# Altium project RK3288.PrjPcb (part 2 of 2)

## Sheet 19.SchDoc
size 297 x 209 mm
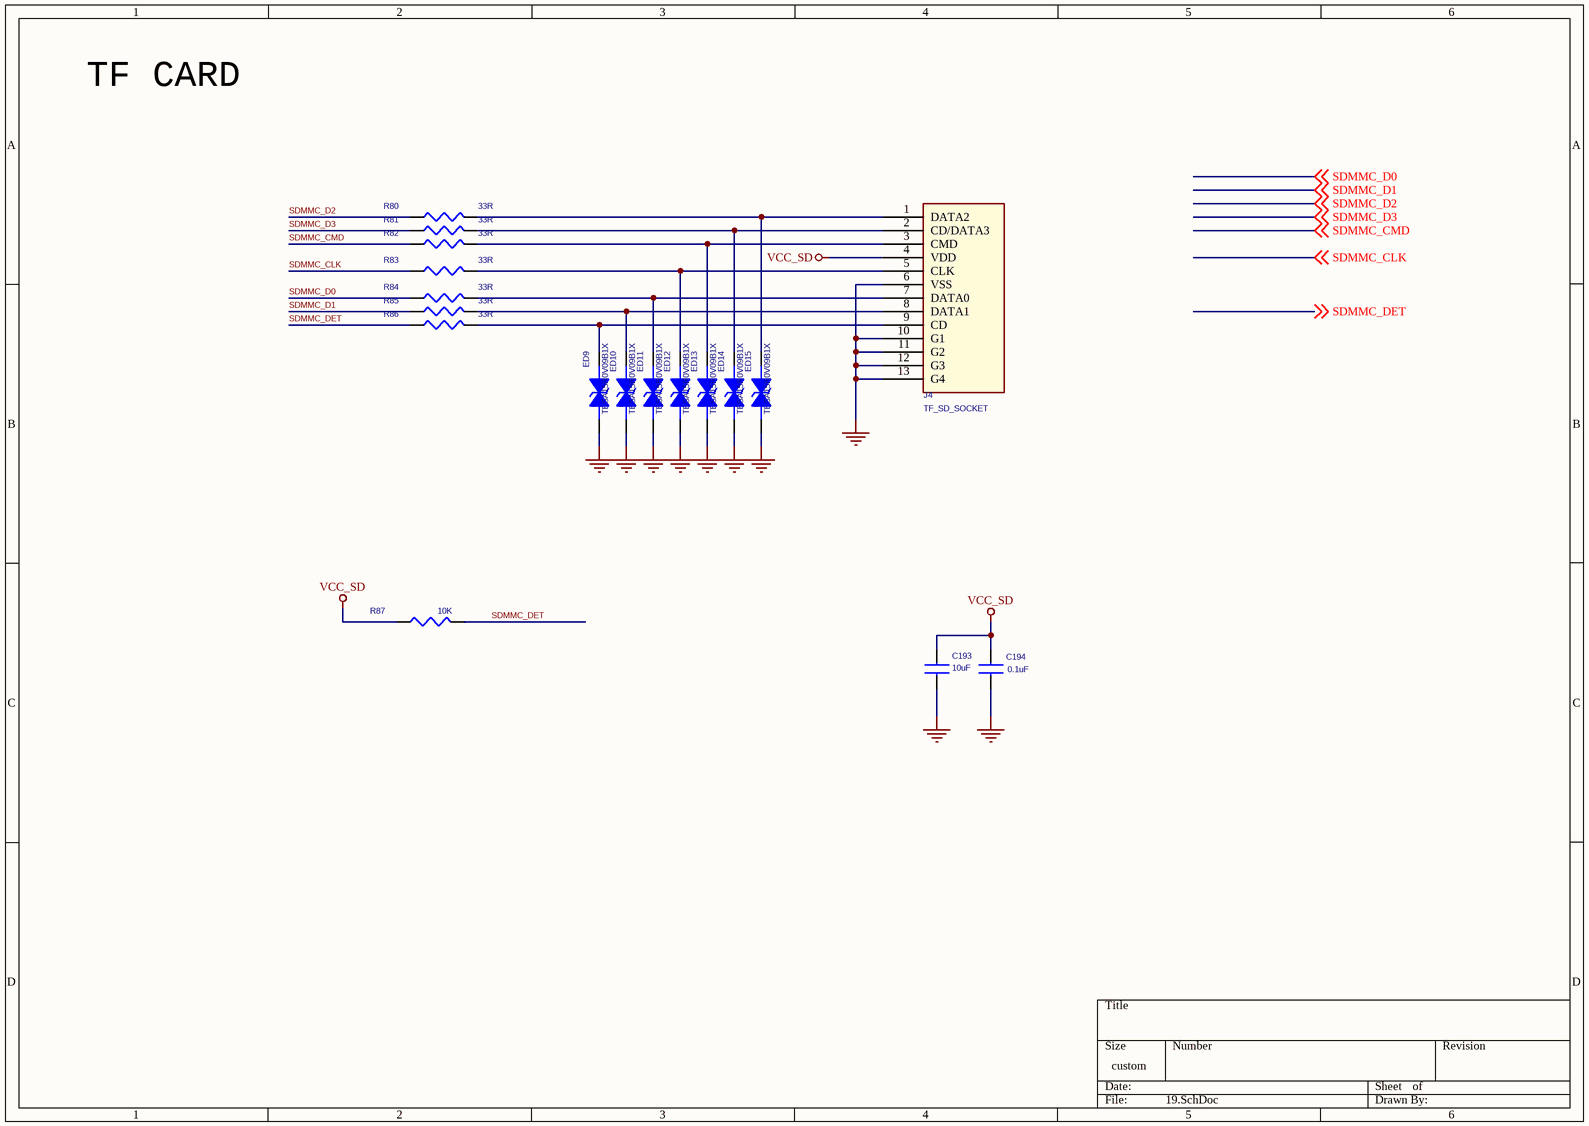
[diagram p19: 19.SchDoc]

### Parts
C193  10uF  [C0603]
C194  0.1uF  [C0603]
ED9  TESA15R0V09B1X  [E0402N]
ED10  TESA15R0V09B1X  [E0402N]
ED11  TESA15R0V09B1X  [E0402N]
ED12  TESA15R0V09B1X  [E0402N]
ED13  TESA15R0V09B1X  [E0402N]
ED14  TESA15R0V09B1X  [E0402N]
ED15  TESA15R0V09B1X  [E0402N]
J4  TF_SD_SOCKET  [TF-CARDKLJ07002]
R80  33R  [r0402]
R81  33R  [r0402]
R82  33R  [r0402]
R83  33R  [r0402]
R84  33R  [r0402]
R85  33R  [r0402]
R86  33R  [r0402]
R87  10K  [r0402]

### Nets
GND: C193.1 C194.2 ED9.2 ED10.2 ED11.2 ED12.2 ED13.2 ED14.2 ED15.2 J4.6(VSS) J4.10(G1) J4.11(G2) J4.12(G3) J4.13(G4)
VCC_SD: C193.2 C194.1 J4.4(VDD) R87.1
SDMMC_CLK: R83.1 ; off-sheet SDMMC_CLK
SDMMC_CMD: R82.1 ; off-sheet SDMMC_CMD
SDMMC_D0: R84.1 ; off-sheet SDMMC_D0
SDMMC_D1: R85.1 ; off-sheet SDMMC_D1
SDMMC_D2: R80.1 ; off-sheet SDMMC_D2
SDMMC_D3: R81.1 ; off-sheet SDMMC_D3
SDMMC_DET: R86.1 R87.2 ; off-sheet SDMMC_DET
NetED9_1: ED9.1 J4.9(CD) R86.2
NetED10_1: ED10.1 J4.8(DATA1) R85.2
NetED11_1: ED11.1 J4.7(DATA0) R84.2
NetED12_1: ED12.1 J4.5(CLK) R83.2
NetED13_1: ED13.1 J4.3(CMD) R82.2
NetED14_1: ED14.1 J4.2(CD/DATA3) R81.2
NetED15_1: ED15.1 J4.1(DATA2) R80.2

### Notes on the sheet
- TF CARD

### Library data of the parts
C193 = CAP NP_Dup3: CAP,MLCC,10uF,+/-10%,X5R,6.3V,SMD0805
C194 = CAP NP_Dup3: CAP,MLCC,100nF,+/-10%,X7R,6.3V,SMD0402
ED9-ED15 = TVS: ESD Component,5V,30P,SMD,0402
J4 = SD_SOCKET_0
R80-R87 = RESISTOR_1_Dup2

## Sheet 20.SchDoc
size 431 x 322 mm
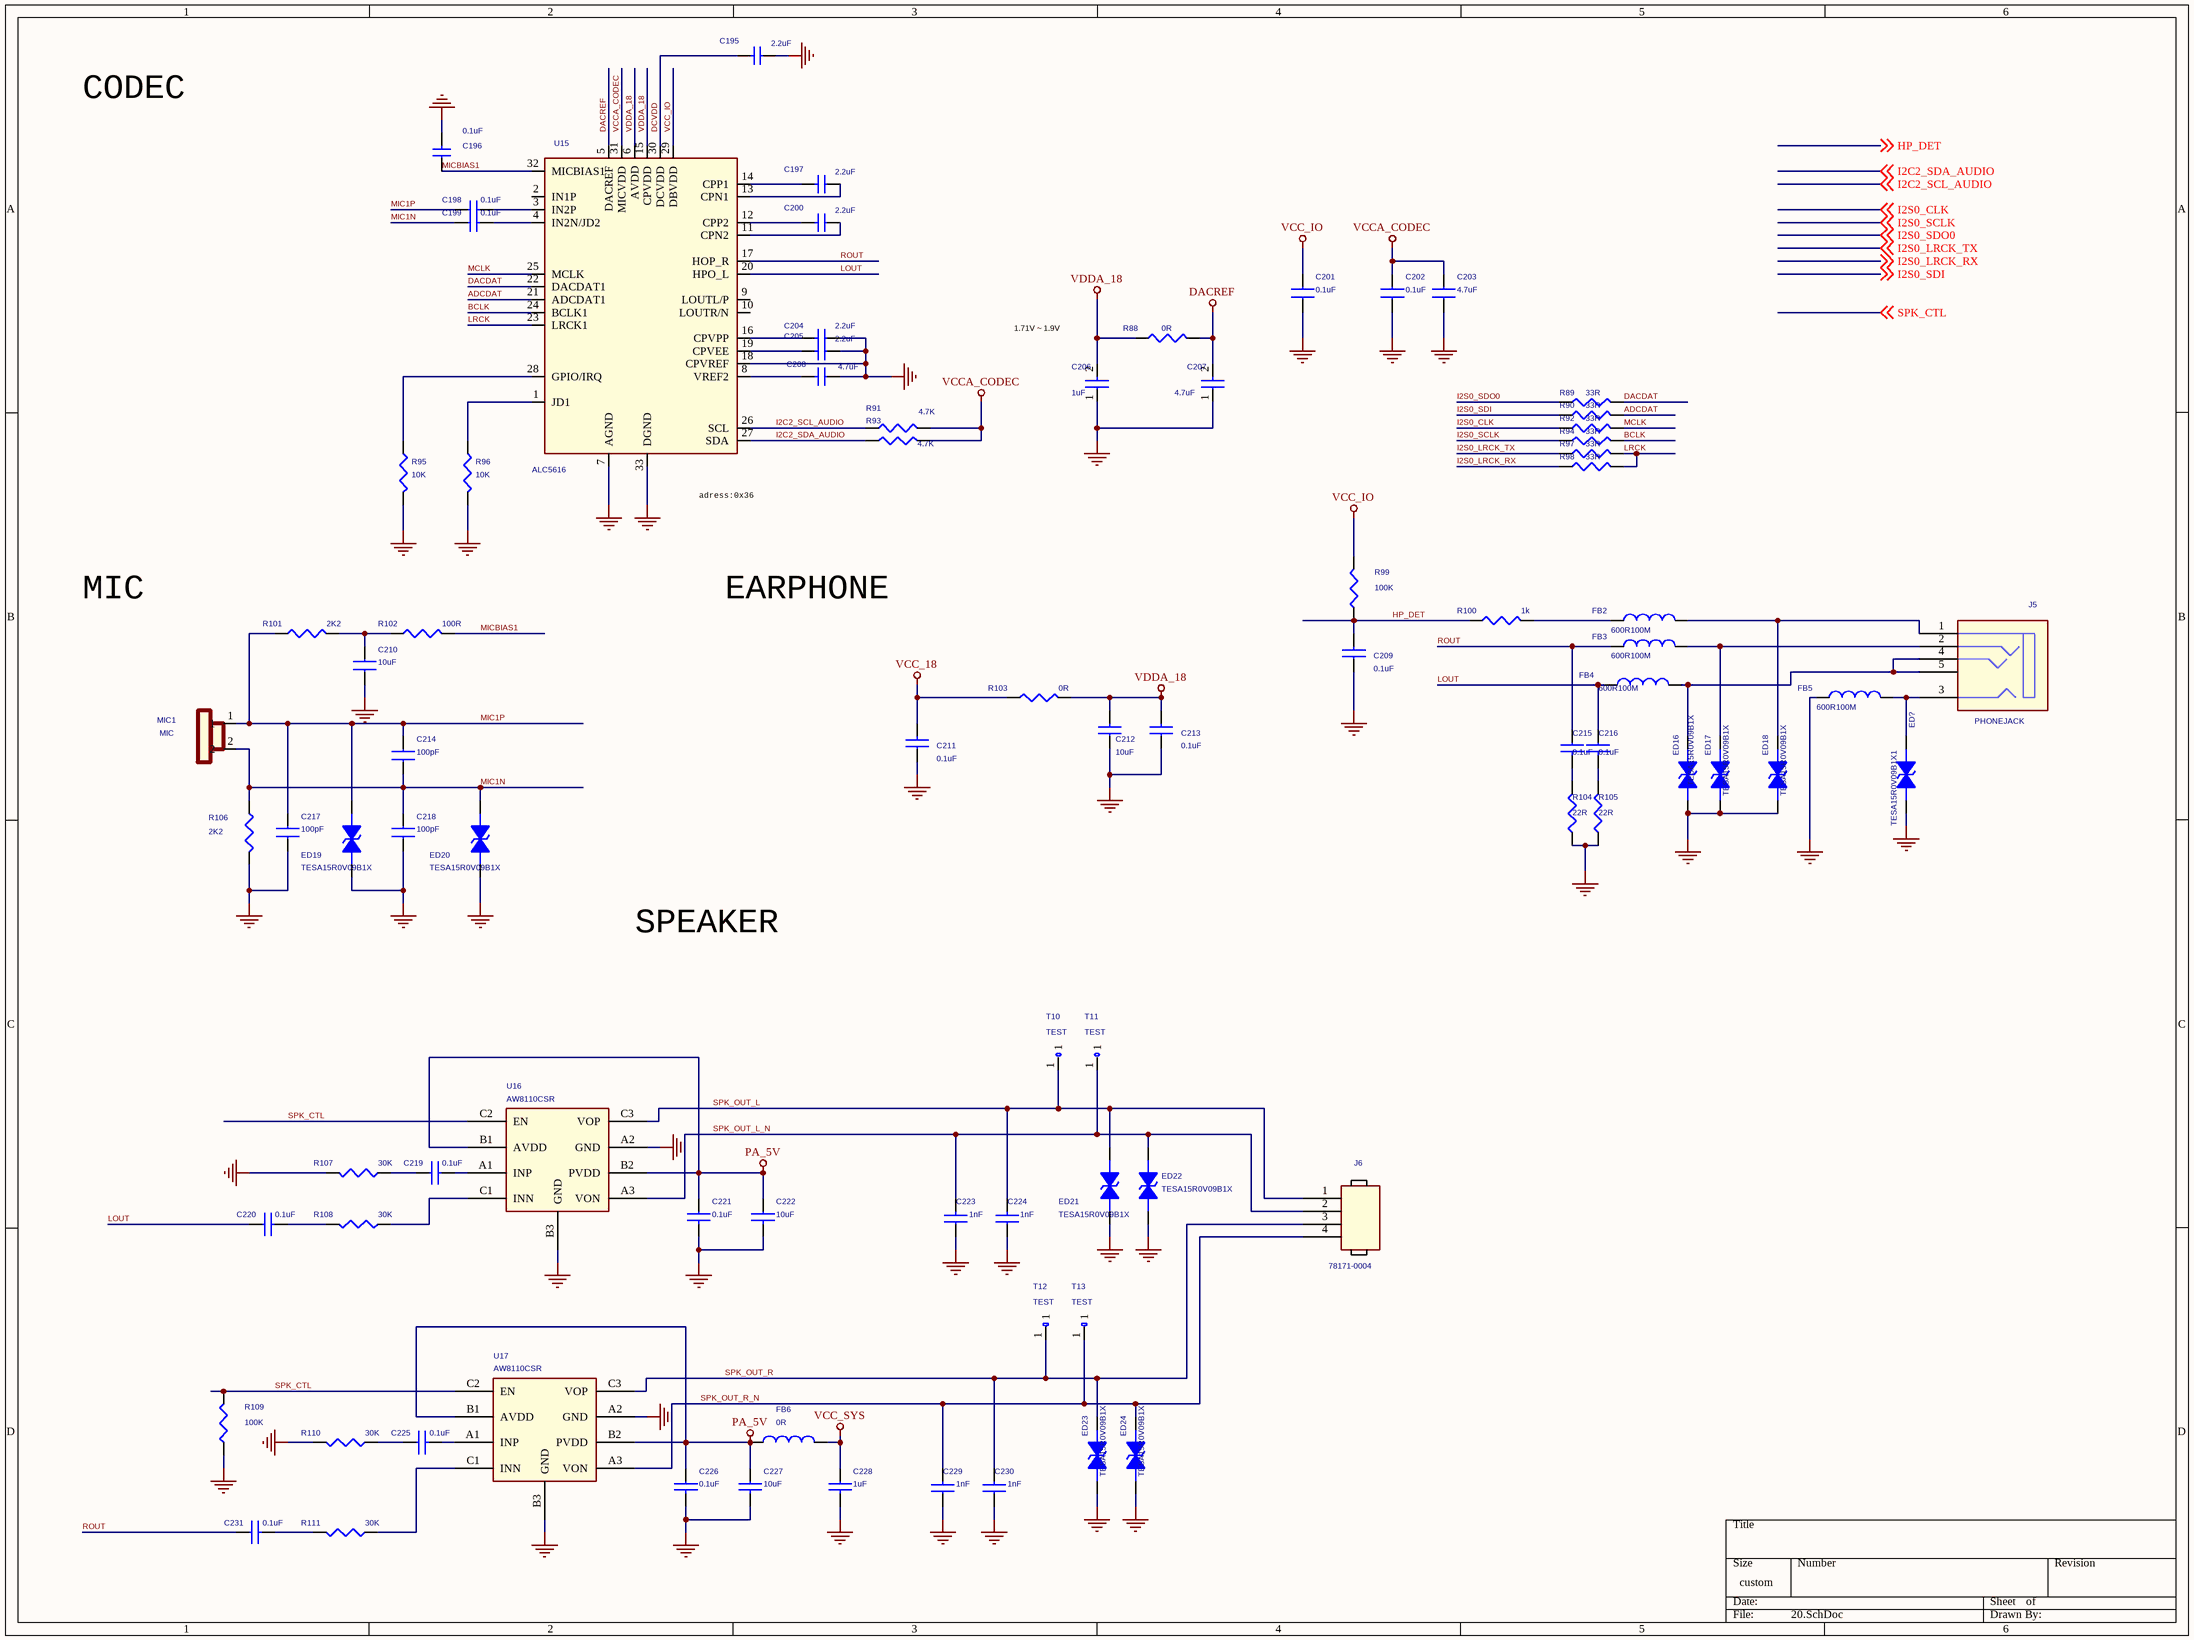
[diagram p20: 20.SchDoc]

### Parts
C195  2.2uF  [C0603]
C196  0.1uF  [c0402]
C197  2.2uF  [C0603]
C198  0.1uF  [c0402]
C199  0.1uF  [c0402]
C200  2.2uF  [C0603]
C201  0.1uF  [C0603]
C202  0.1uF  [C0603]
C203  4.7uF  [C0603]
C204  2.2uF  [C0603]
C205  2.2uF  [C0603]
C206  1uF  [c0402]
C207  4.7uF  [C0603]
C208  4.7uF  [C0603]
C209  0.1uF  [c0402]
C210  10uF  [C0603]
C211  0.1uF  [C0201]
C212  10uF  [C0603]
C213  0.1uF  [c0402]
C214  100pF  [C0603]
C215  0.1uF  [c0402]
C216  0.1uF  [c0402]
C217  100pF  [C0603]
C218  100pF  [C0603]
C219  0.1uF  [C0402]
C220  0.1uF  [C0402]
C221  0.1uF  [C0402]
C222  10uF  [C0402]
C223  1nF  [C0402]
C224  1nF  [C0402]
C225  0.1uF  [C0402]
C226  0.1uF  [C0402]
C227  10uF  [C0402]
C228  1uF  [C0402]
C229  1nF  [C0402]
C230  1nF  [C0402]
C231  0.1uF  [C0402]
ED16  TESA15R0V09B1X  [E0402N]
ED17  TESA15R0V09B1X  [E0402N]
ED18  TESA15R0V09B1X  [E0402N]
ED19  TESA15R0V09B1X  [E0201]
ED20  TESA15R0V09B1X  [E0201]
ED21  TESA15R0V09B1X  [E0201]
ED22  TESA15R0V09B1X  [E0201]
ED23  TESA15R0V09B1X  [E0402N]
ED24  TESA15R0V09B1X  [E0402N]
FB2  600R100M  [L0402]
FB3  600R100M  [L0402]
FB4  600R100M  [L0402]
FB5  600R100M  [L0402]
FB6  0R  [L0603]
J5  PHONEJACK  [J301R05GA6ZL2]
J6  78171-0004  [78171-0004]
MIC1  MIC  [78171-0002]
R88  0R  [R0402]
R89  33R  [r0402]
R90  33R  [r0402]
R91  4.7K  [r0402]
R92  33R  [r0402]
R93  4.7K  [r0402]
R94  33R  [r0402]
R95  10K  [r0402]
R96  10K  [r0402]
R97  33R  [r0402]
R98  33R  [r0402]
R99  100K  [r0402]
R100  1k  [r0402]
R101  2K2  [r0402]
R102  100R  [r0402]
R103  0R  [R0402]
R104  22R  [r0402]
R105  22R  [r0402]
R106  2K2  [r0402]
R107  30K  [R0402]
R108  30K  [R0402]
R109  100K  [r0402]
R110  30K  [R0402]
R111  30K  [R0402]
T10  TEST  [TEST]
T11  TEST  [TEST]
T12  TEST  [TEST]
T13  TEST  [TEST]
TESA15R0V09B1X1  ED?  [E0402N]
U15  ALC5616  [QFN32]
U16  AW8110CSR  [CSP9]
U17  AW8110CSR  [CSP9]

### Nets
DACREF: C207.2 R88.2 U15.5(DACREF)
GND: C195.1 C196.2 C201.1 C202.1 C203.1 C204.1 C205.1 C206.1 C207.1 C208.1 C209.1 C210.1 C211.1 C212.1 C213.1 C217.1 C218.1 C221.2 C222.2 C223.1 C224.1 C226.2 C227.2 C228.2 C229.1 C230.1 ED16.2 ED17.2 ED18.2 ED19.2 ED20.2 ED21.2 ED22.2 ED23.2 ED24.2 FB5.2 R95.1 R96.1 R104.1 R105.1 R106.1 R107.2 R109.2 R110.2 TESA15R0V09B1X1.2 U15.7(AGND) U15.18(CPVREF) U15.33(DGND) U16.A2(GND) U16.B3(GND) U17.A2(GND) U17.B3(GND)
PA_5V: C221.1 C222.1 C226.1 C227.1 FB6.2 U16.B1(AVDD) U16.B2(PVDD) U17.B1(AVDD) U17.B2(PVDD)
VCC_18: C211.2 R103.1
VCC_IO: C201.2 R99.1 U15.29(DBVDD)
VCC_SYS: C228.1 FB6.1
VCCA_CODEC: C202.2 C203.2 R91.2 R93.2 U15.31(MICVDD)
VDDA_18: C206.2 C212.2 C213.2 R88.1 R103.2 U15.6(AVDD) U15.15(CPVDD)
ADCDAT: R90.2 U15.21(ADCDAT1)
BCLK: R94.2 U15.24(BCLK1)
DACDAT: R89.2 U15.22(DACDAT1)
DCVDD: C195.2 U15.30(DCVDD)
HP_DET: C209.2 R99.2 R100.2 ; off-sheet HP_DET
I2C2_SCL_AUDIO: R91.1 U15.26(SCL) ; off-sheet I2C2_SCL_AUDIO
I2C2_SDA_AUDIO: R93.1 U15.27(SDA) ; off-sheet I2C2_SDA_AUDIO
I2S0_CLK: R92.1 ; off-sheet I2S0_CLK
I2S0_LRCK_RX: R98.1 ; off-sheet I2S0_LRCK_RX
I2S0_LRCK_TX: R97.1 ; off-sheet I2S0_LRCK_TX
I2S0_SCLK: R94.1 ; off-sheet I2S0_SCLK
I2S0_SDI: R90.1 ; off-sheet I2S0_SDI
I2S0_SDO0: R89.1 ; off-sheet I2S0_SDO0
LOUT: C216.1 C220.1 FB4.2 U15.20(HPO_L)
LRCK: R97.2 R98.2 U15.23(LRCK1)
MCLK: R92.2 U15.25(MCLK)
MIC1N: C199.1 C214.1 C218.2 ED20.1 MIC1.2 R106.2
MIC1P: C198.1 C214.2 C217.2 ED19.1 MIC1.1 R101.1
MICBIAS1: C196.1 R102.1 U15.32(MICBIAS1)
ROUT: C215.1 C231.1 FB3.2 U15.17(HOP_R)
SPK_CTL: R109.1 U16.C2(EN) U17.C2(EN) ; off-sheet SPK_CTL
SPK_OUT_L: C224.2 ED21.1 J6.1 T10.1 U16.C3(VOP)
SPK_OUT_L_N: C223.2 ED22.1 J6.2 T11.1 U16.A3(VON)
SPK_OUT_R: C230.2 ED23.1 J6.3 T12.1 U17.C3(VOP)
SPK_OUT_R_N: C229.2 ED24.1 J6.4 T13.1 U17.A3(VON)
NetC197_1: C197.1 U15.13(CPN1)
NetC197_2: C197.2 U15.14(CPP1)
NetC198_2: C198.2 U15.3(IN2P)
NetC199_2: C199.2 U15.4(IN2N/JD2)
NetC200_1: C200.1 U15.11(CPN2)
NetC200_2: C200.2 U15.12(CPP2)
NetC204_2: C204.2 U15.16(CPVPP)
NetC205_2: C205.2 U15.19(CPVEE)
NetC208_2: C208.2 U15.8(VREF2)
NetC210_2: C210.2 R101.2 R102.2
NetC215_2: C215.2 R104.2
NetC216_2: C216.2 R105.2
NetC219_1: C219.1 R107.1
NetC219_2: C219.2 U16.A1(INP)
NetC220_2: C220.2 R108.2
NetC225_1: C225.1 R110.1
NetC225_2: C225.2 U17.A1(INP)
NetC231_2: C231.2 R111.2
NetED16_1: ED16.1 FB4.1 J5.4(R) J5.5(L)
NetED17_1: ED17.1 FB3.1 J5.2(D)
NetED18_1: ED18.1 FB2.1 J5.1(HP)
NetFB2_2: FB2.2 R100.1
NetFB5_1: FB5.1 J5.3(R1) TESA15R0V09B1X1.1
NetR95_2: R95.2 U15.28(GPIO/IRQ)
NetR96_2: R96.2 U15.1(JD1)
NetR108_1: R108.1 U16.C1(INN)
NetR111_1: R111.1 U17.C1(INN)

Not connected (* = marked no-connect by the designer): U15 2(IN1P) 9(LOUTL/P) 10(LOUTR/N)

### Notes on the sheet
- CODEC
- 1.71V ~ 1.9V
- (near U15) adress:0x36
- MIC
- EARPHONE
- SPEAKER

### Library data of the parts
C195 C197 C200 C204 C205 = SMALL CAP: RoHS CHIP CAP 2.2uF +10/-10% X5R
C196 C198 C199 = SMALL CAP: RoHS CHIP CAP 0.1uF +10/-10% X7R
C201 C202 = CAP NP_Dup3: RoHS CHIP CAP 0.1uF +10/-10% X7R
C203 = CAP NP_Dup3: RoHS CHIP CAP 2.2uF +10/-10% X5R
C206 C207 = CAP NP_0: RoHS CHIP CAP 4.7uF +10/-10% X5R
C208 = SMALL CAP: RoHS CHIP CAP 4.7uF +10/-10% X5R
C209 C211-C213 = CAP NP_4
C210 = CAP NP_Dup3
C214 C217 C218 = CAP NP_Dup3: RoHS CHIP CAP 100pF +10/-10% X7R
C215 C216 = CAP NP_Dup1: RoHS CHIP CAP 0.1uF +10/-10% X7R
C219-C221 C225 C226 C231 = CAP NP_Dup2: RoHS CHIP CAP 0.1uF +10/-10% X7R
C222 C227 C228 = CAP NP_Dup2: RoHS CHIP CAP 10uF +10/-10% X5R; ROOM: USB+5V; MARK: 106
C223 C224 C229 C230 = CAP NP_Dup2: RoHS CHIP CAP 1nF +10/-10% X7R
ED16-ED18 ED23 ED24 TESA15R0V09B1X1 = TVS: ESD Component,5V,30P,SMD,0402
ED19-ED22 = DIODE BI-DIR TRIG: NC/ESD Component,5V,30P,SMD,0402
FB2-FB5 = INDUCTOR_Dup1: ROHS CHIP RES 33R 1/16W 5%; Supplier: MURATA; Supplier P/N: BLM18PG181SN1D
FB6 = INDUCTOR_Dup1: ROHS CHIP RES 0 Ohm 1/16W +/-5%; Supplier P/N: BLM18PG181SN1D; Supplier: MURATA
J5 = PHONEJACK STEREO SW_0: 耳插
J6 = HEADER 4
R88 R91 R93 = R: ROHS CHIP RES 0 Ohm 1/16W +/-5%
R89 R90 R92 R94 R97 R98 = R: ROHS CHIP RES 33 Ohm 1/16W +/-5%
R95 R96 = RESISTOR: ROHS CHIP RES 10K 1/16W +/-5%
R99 R100 R102 R109 = RESISTOR_1_Dup2: RES,thick film,10KOhm,+/-5%,1/16W,SMD0402
R101 = RESISTOR_0_Dup2
R103 = RESISTOR: ROHS CHIP RES 0R 1/16W 5%
R104 R105 = RESISTOR: ROHS CHIP RES 22R 1/16W 5%
R106 = RESISTOR_0_Dup2: 贴片电阻
R107 R108 R110 R111 = RESISTOR_Dup1: ROHS CHIP RES 30K 1/16W +/-5%
T10-T13 = TEST_0
U15 = ALC5616: CODEC IC
U16 U17 = LM4990_0: Class D Audio AMP

## Sheet 21.SchDoc
size 297 x 209 mm
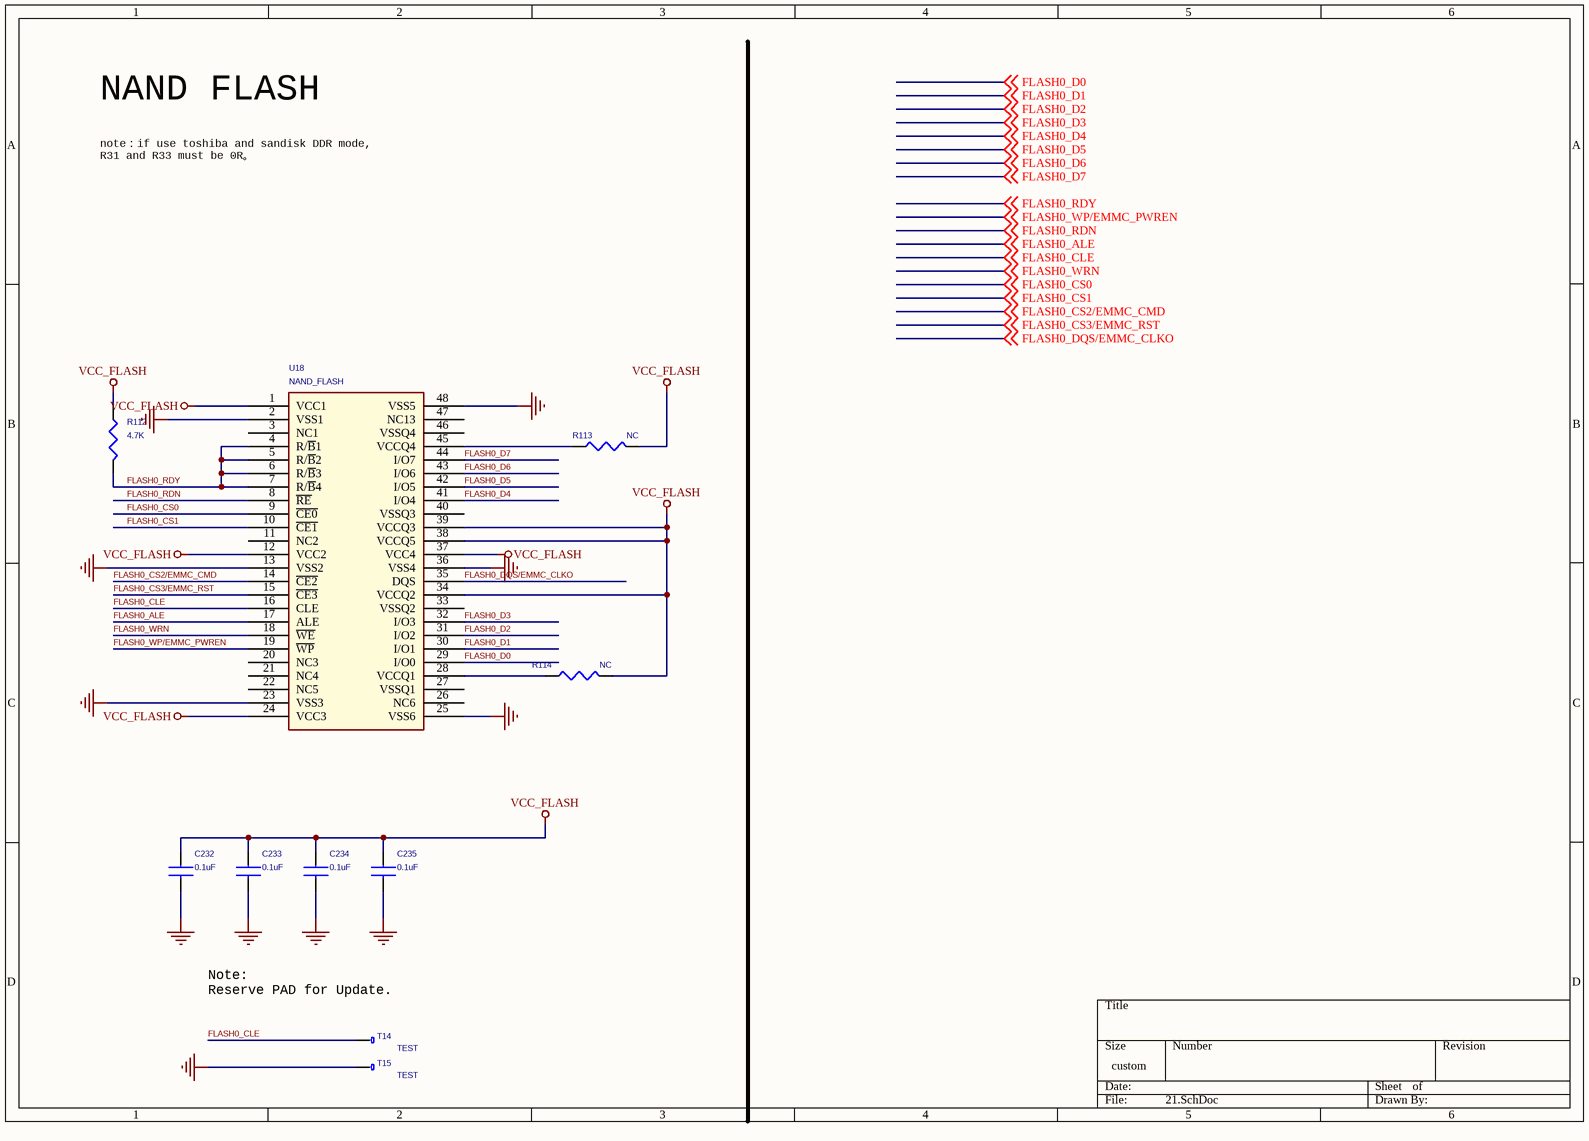
[diagram p21: 21.SchDoc]

### Parts
C232  0.1uF  [C0603]
C233  0.1uF  [C0603]
C234  0.1uF  [C0603]
C235  0.1uF  [C0603]
R112  4.7K  [R0402]
R113  NC  [R0402]
R114  NC  [R0402]
T14  TEST  [TEST]
T15  TEST  [TEST]
U18  NAND_FLASH  [TSOP1-48]

### Nets
GND: C232.1 C233.1 C234.1 C235.1 T15.1 U18.2(VSS1) U18.13(VSS2) U18.23(VSS3) U18.25(VSS6) U18.36(VSS4) U18.48(VSS5)
VCC_FLASH: C232.2 C233.2 C234.2 C235.2 R112.1 R113.2 R114.2 U18.1(VCC1) U18.12(VCC2) U18.24(VCC3) U18.34(VCCQ2) U18.37(VCC4) U18.38(VCCQ5) U18.39(VCCQ3)
FLASH0_ALE: U18.17(ALE) ; off-sheet FLASH0_ALE
FLASH0_CLE: T14.1 U18.16(CLE) ; off-sheet FLASH0_CLE
FLASH0_CS0: U18.9(~{CE0}) ; off-sheet FLASH0_CS0
FLASH0_CS1: U18.10(~{CE1}) ; off-sheet FLASH0_CS1
FLASH0_CS2/EMMC_CMD: U18.14(~{CE2}) ; off-sheet FLASH0_CS2/EMMC_CMD
FLASH0_CS3/EMMC_RST: U18.15(~{CE3}) ; off-sheet FLASH0_CS3/EMMC_RST
FLASH0_D0: U18.29(I/O0) ; off-sheet FLASH0_D0
FLASH0_D1: U18.30(I/O1) ; off-sheet FLASH0_D1
FLASH0_D2: U18.31(I/O2) ; off-sheet FLASH0_D2
FLASH0_D3: U18.32(I/O3) ; off-sheet FLASH0_D3
FLASH0_D4: U18.41(I/O4) ; off-sheet FLASH0_D4
FLASH0_D5: U18.42(I/O5) ; off-sheet FLASH0_D5
FLASH0_D6: U18.43(I/O6) ; off-sheet FLASH0_D6
FLASH0_D7: U18.44(I/O7) ; off-sheet FLASH0_D7
FLASH0_DQS/EMMC_CLKO: U18.35(DQS) ; off-sheet FLASH0_DQS/EMMC_CLKO
FLASH0_RDN: U18.8(~{RE}) ; off-sheet FLASH0_RDN
FLASH0_RDY: R112.2 U18.4(R/~{B}1) U18.5(R/~{B}2) U18.6(R/~{B}3) U18.7(R/~{B}4) ; off-sheet FLASH0_RDY
FLASH0_WP/EMMC_PWREN: U18.19(~{WP}) ; off-sheet FLASH0_WP/EMMC_PWREN
FLASH0_WRN: U18.18(~{WE}) ; off-sheet FLASH0_WRN
NetR113_1: R113.1 U18.45(VCCQ4)
NetR114_1: R114.1 U18.28(VCCQ1)

Not connected (* = marked no-connect by the designer): U18 3(NC1) 11(NC2) 20(NC3) 21(NC4) 22(NC5) 26(NC6) 27(VSSQ1) 33(VSSQ2) 40(VSSQ3) 46(VSSQ4) 47(NC13)

### Notes on the sheet
- NAND FLASH
- note：if use toshiba and sandisk DDR mode,
  R31 and R33 must be 0R。
- (near T14) Note:
  Reserve PAD for Update.

### Library data of the parts
C232-C235 = CAP NP_Dup3: RoHS CHIP CAP 0.1uF +10/-10% X7R
R112 = RESISTOR_Dup1: ROHS CHIP RES 4.7K 1/16W +/-5%
R113 R114 = RESISTOR_Dup1
T14 T15 = TEST_1
U18 = NANDFLASH_0: NAND Flash,2.7V,3.3V,3.6V,2G*8,N/A,-40℃~85℃,TSOP-48P; NAND FLASH: 1

## Sheet 22.SchDoc
size 297 x 209 mm
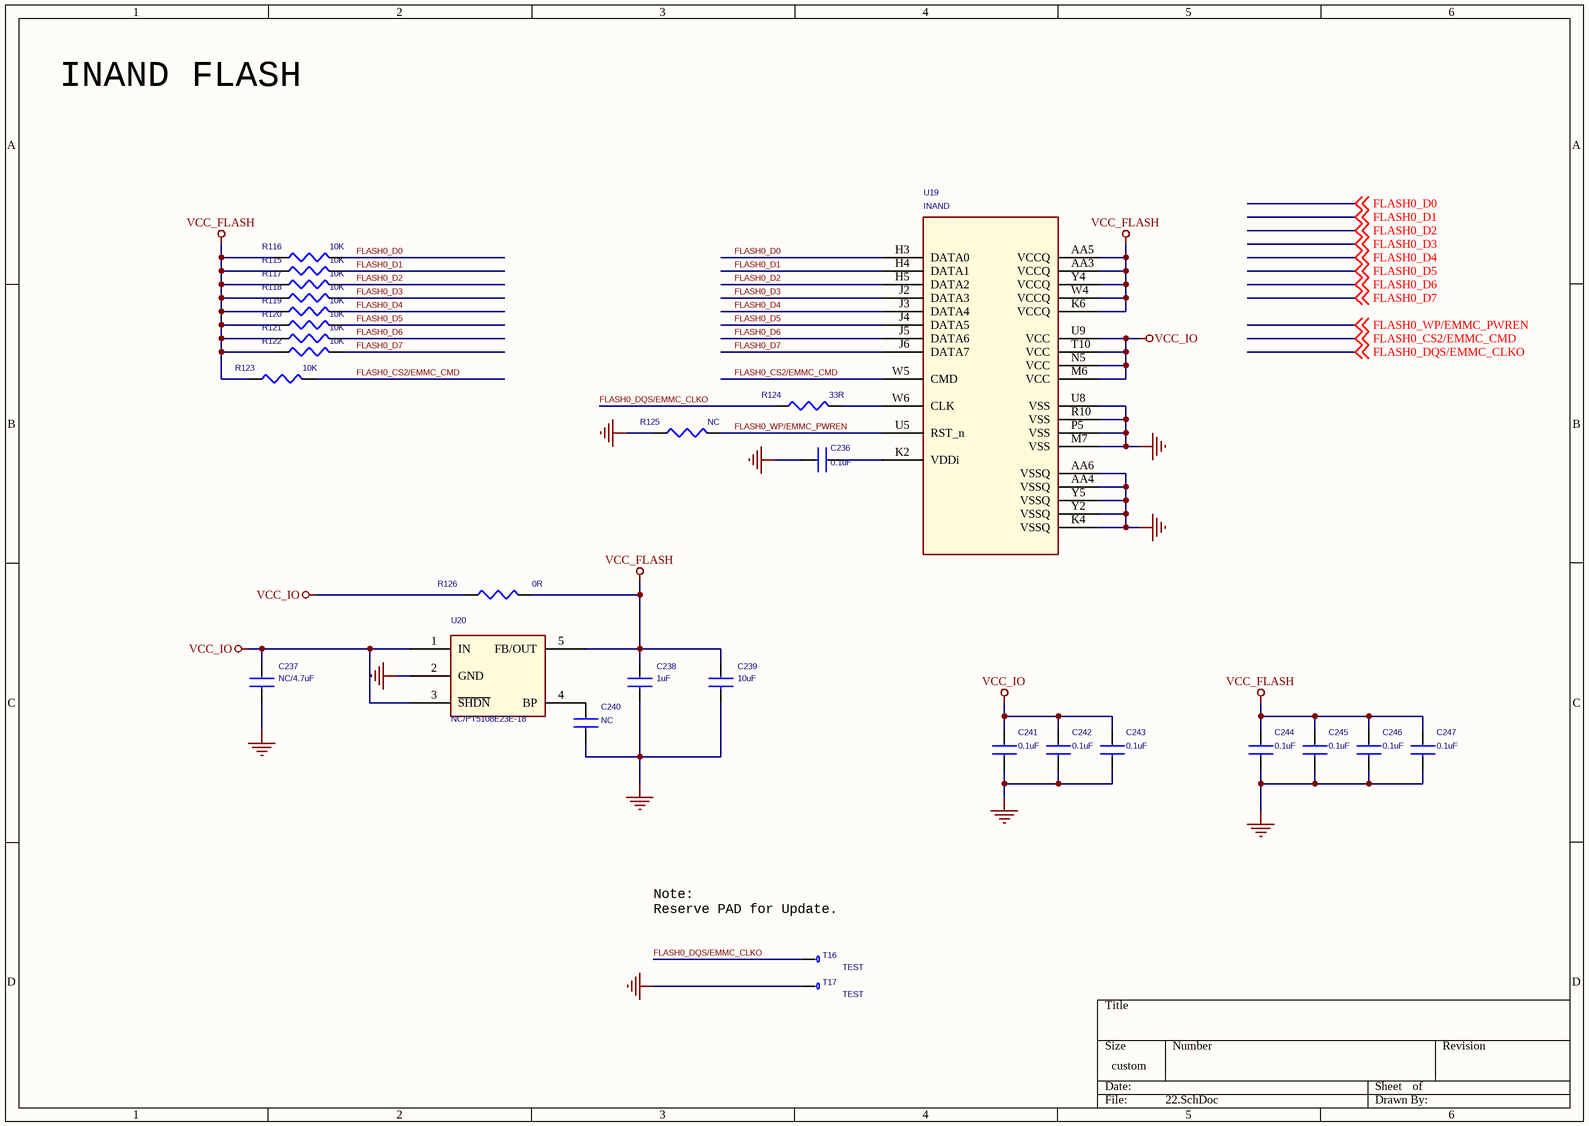
[diagram p22: 22.SchDoc]

### Parts
C236  0.1uF  [C0603]
C237  NC/4.7uF  [C0603]
C238  1uF  [C0603]
C239  10uF  [C0603]
C240  NC  [C0603]
C241  0.1uF  [C0603]
C242  0.1uF  [C0603]
C243  0.1uF  [C0603]
C244  0.1uF  [C0603]
C245  0.1uF  [C0603]
C246  0.1uF  [C0603]
C247  0.1uF  [C0603]
R115  10K  [R0402]
R116  10K  [R0402]
R117  10K  [R0402]
R118  10K  [R0402]
R119  10K  [R0402]
R120  10K  [R0402]
R121  10K  [R0402]
R122  10K  [R0402]
R123  10K  [R0402]
R124  33R  [R0402]
R125  NC  [R0402]
R126  0R  [R0402]
T16  TEST  [TEST]
T17  TEST  [TEST]
U19  INAND  [INANA-BGA169]
U20  NC/PT5108E23E-18  [SOT25]

### Nets
GND: C236.1 C237.2 C238.2 C239.2 C240.1 C241.1 C242.1 C243.1 C244.1 C245.1 C246.1 C247.1 R125.1 T17.1 U19.AA4(VSSQ) U19.AA6(VSSQ) U19.K4(VSSQ) U19.M7(VSS) U19.P5(VSS) U19.R10(VSS) U19.U8(VSS) U19.Y2(VSSQ) U19.Y5(VSSQ) U20.2(GND)
VCC_FLASH: C238.1 C239.1 C244.2 C245.2 C246.2 C247.2 R115.1 R116.1 R117.1 R118.1 R119.1 R120.1 R121.1 R122.1 R123.1 R126.2 U19.AA3(VCCQ) U19.AA5(VCCQ) U19.K6(VCCQ) U19.W4(VCCQ) U19.Y4(VCCQ) U20.5(FB/OUT)
VCC_IO: C237.1 C241.2 C242.2 C243.2 R126.1 U19.M6(VCC) U19.N5(VCC) U19.T10(VCC) U19.U9(VCC) U20.1(IN) U20.3(~{SHDN})
FLASH0_CS2/EMMC_CMD: R123.2 U19.W5(CMD) ; off-sheet FLASH0_CS2/EMMC_CMD
FLASH0_D0: R116.2 U19.H3(DATA0) ; off-sheet FLASH0_D0
FLASH0_D1: R115.2 U19.H4(DATA1) ; off-sheet FLASH0_D1
FLASH0_D2: R117.2 U19.H5(DATA2) ; off-sheet FLASH0_D2
FLASH0_D3: R118.2 U19.J2(DATA3) ; off-sheet FLASH0_D3
FLASH0_D4: R119.2 U19.J3(DATA4) ; off-sheet FLASH0_D4
FLASH0_D5: R120.2 U19.J4(DATA5) ; off-sheet FLASH0_D5
FLASH0_D6: R121.2 U19.J5(DATA6) ; off-sheet FLASH0_D6
FLASH0_D7: R122.2 U19.J6(DATA7) ; off-sheet FLASH0_D7
FLASH0_DQS/EMMC_CLKO: R124.1 T16.1 ; off-sheet FLASH0_DQS/EMMC_CLKO
FLASH0_WP/EMMC_PWREN: R125.2 U19.U5(RST_n) ; off-sheet FLASH0_WP/EMMC_PWREN
NetC236_2: C236.2 U19.K2(VDDi)
NetC240_2: C240.2 U20.4(BP)
NetR124_2: R124.2 U19.W6(CLK)

### Notes on the sheet
- INAND FLASH
- (near T16) Note:
  Reserve PAD for Update.

### Library data of the parts
C236 C240-C247 = CAP NP_Dup3: RoHS CHIP CAP 0.1uF +10/-10% X7R
C237-C239 = CAP NP_Dup3: RoHS CHIP CAP 4.7uF +10/-10% X5R
R115-R123 = RESISTOR_Dup1: ROHS CHIP RES 10K 1/16W +/-5%
R124 = RESISTOR_Dup1: NC
R125 = RESISTOR_Dup1
R126 = RESISTOR_Dup1: ROHS CHIP RES 10K 1/16W 5%
T16 T17 = TEST_1
U19 = INAND: NAND Flash,H26M54001BKR,2.7V,3.3V,3.6V,128G,N/A,-25℃~85℃,FBGA-169P
U20 = DS8008_4

## Sheet 23.SchDoc
size 297 x 209 mm
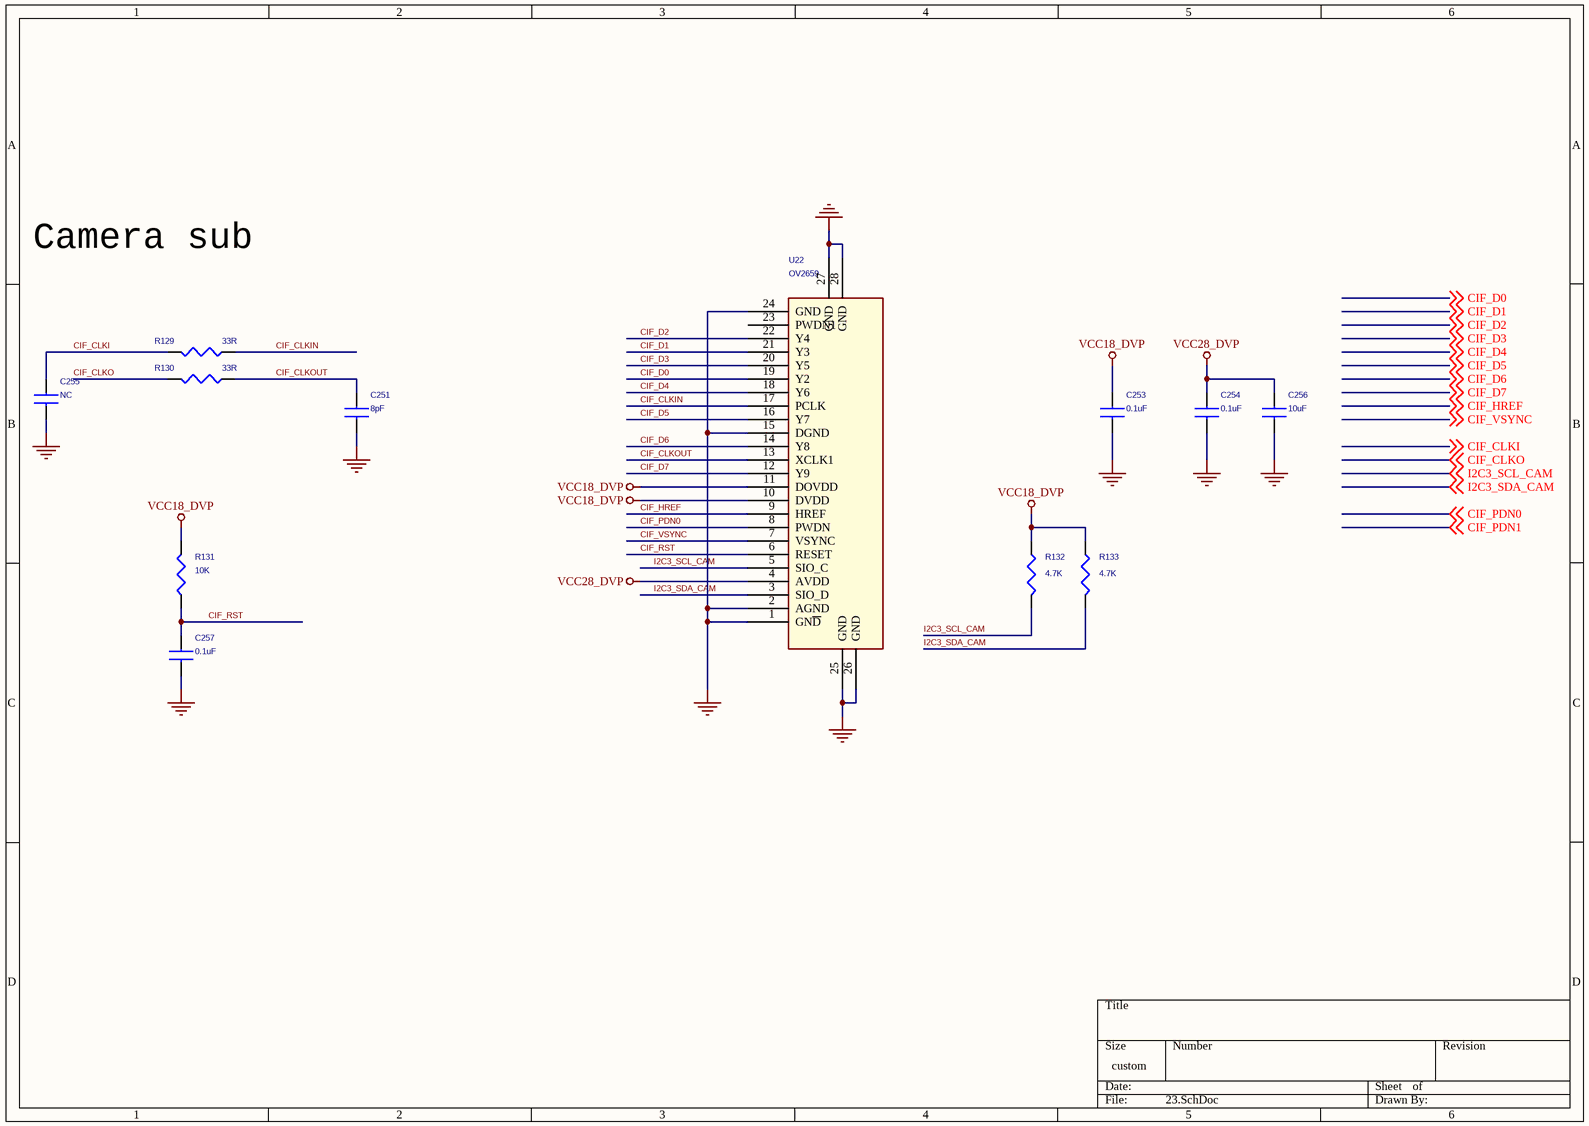
[diagram p23: 23.SchDoc]

### Parts
C251  8pF  [C0603]
C253  0.1uF  [C0603]
C254  0.1uF  [C0603]
C255  NC  [C0603]
C256  10uF  [C0603]
C257  0.1uF  [C0603]
R129  33R  [r0402]
R130  33R  [r0402]
R131  10K  [r0402]
R132  4.7K  [r0402]
R133  4.7K  [r0402]
U22  OV2659  [AXT524124]

### Nets
GND: C251.1 C253.1 C254.1 C255.1 C256.1 C257.1 U22.1(GN~{D}) U22.2(AGND) U22.15(DGND) U22.24(GND) U22.25(GND) U22.26(GND) U22.27(GND) U22.28(GND)
VCC18_DVP: C253.2 R131.2 R132.1 R133.1 U22.10(DVDD) U22.11(DOVDD)
VCC28_DVP: C254.2 C256.2 U22.4(AVDD)
CIF_CLKI: C255.2 R129.2 ; off-sheet CIF_CLKI
CIF_CLKIN: R129.1 U22.17(PCLK)
CIF_CLKO: R130.2 ; off-sheet CIF_CLKO
CIF_CLKOUT: C251.2 R130.1 U22.13(XCLK1)
CIF_D0: U22.19(Y2) ; off-sheet CIF_D0
CIF_D1: U22.21(Y3) ; off-sheet CIF_D1
CIF_D2: U22.22(Y4) ; off-sheet CIF_D2
CIF_D3: U22.20(Y5) ; off-sheet CIF_D3
CIF_D4: U22.18(Y6) ; off-sheet CIF_D4
CIF_D5: U22.16(Y7) ; off-sheet CIF_D5
CIF_D6: U22.14(Y8) ; off-sheet CIF_D6
CIF_D7: U22.12(Y9) ; off-sheet CIF_D7
CIF_HREF: U22.9(HREF) ; off-sheet CIF_HREF
CIF_PDN0: U22.8(PWDN) ; off-sheet CIF_PDN0
CIF_RST: C257.2 R131.1 U22.6(RESET)
CIF_VSYNC: U22.7(VSYNC) ; off-sheet CIF_VSYNC
I2C3_SCL_CAM: R132.2 U22.5(SIO_C) ; off-sheet I2C3_SCL_CAM
I2C3_SDA_CAM: R133.2 U22.3(SIO_D) ; off-sheet I2C3_SDA_CAM

Not connected (* = marked no-connect by the designer): U22 23(PWDN1)

### Notes on the sheet
- Camera sub

### Library data of the parts
C251 C255 = CAP NP_Dup3: CAP,MLCC,8pF,+/-10%,NPO,6.3V,SMD0402
C253 C254 C256 = CAP NP_Dup3: ROOM: CHG
C257 = CAP NP_Dup3: CAP,MLCC,100nF,+/-10%,X7R,6.3V,SMD0402
R129 R130 = RESISTOR_0_Dup1: RES,thick film,22Ohm,+/-5%,1/16W,SMD0402
R131 = RESISTOR: NC
R132 R133 = RESISTOR_0_Dup3
U22 = LCM0200CE1A0_0

## Sheet 24.SchDoc
size 355 x 254 mm
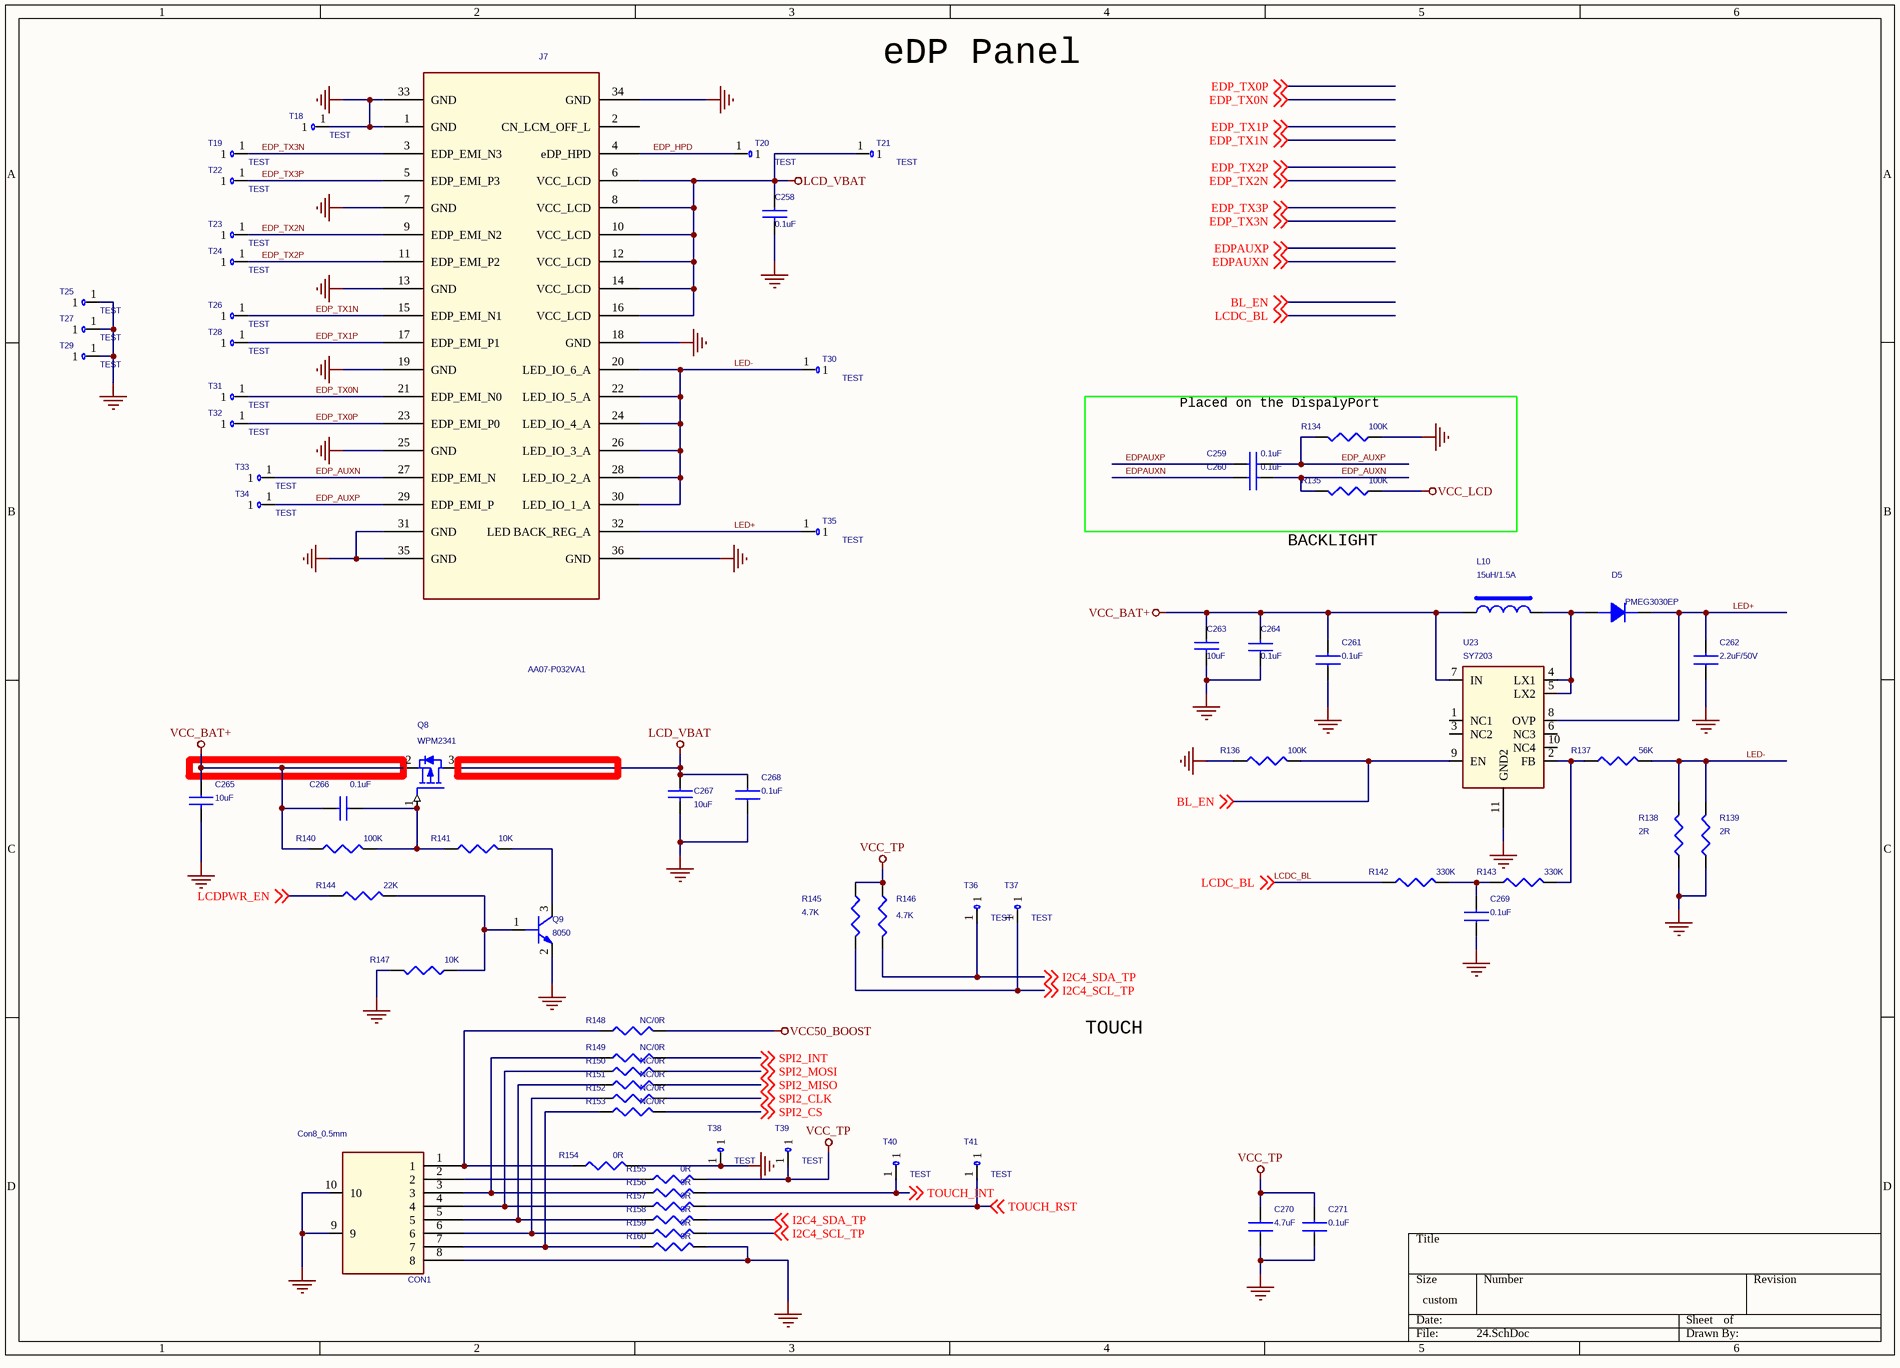
[diagram p24: 24.SchDoc]

### Parts
C258  0.1uF  [c0402]
C259  0.1uF  [c0402]
C260  0.1uF  [c0402]
C261  0.1uF  [C0603]
C262  2.2uF/50V  [C0603]
C263  10uF  [C0603]
C264  0.1uF  [C0402]
C265  10uF  [C0603]
C266  0.1uF  [C0402]
C267  10uF  [C0603]
C268  0.1uF  [C0603]
C269  0.1uF  [C0603]
C270  4.7uF  [C0603]
C271  0.1uF  [C0603]
CON1  Con8_0.5mm  [BL115H_8RL_TA14]
D5  PMEG3030EP  [SOD128]
J7  AA07-P032VA1  [AA07P032VA1N]
L10  15uH/1.5A  [IND-5X5]
Q8  WPM2341  [SOT23]
Q9  8050  [SOT23]
R134  100K  [r0402]
R135  100K  [r0402]
R136  100K  [r0402]
R137  56K  [r0402]
R138  2R  [R1206]
R139  2R  [R1206]
R140  100K  [r0402]
R141  10K  [r0402]
R142  330K  [r0402]
R143  330K  [r0402]
R144  22K  [r0402]
R145  4.7K  [R0402]
R146  4.7K  [R0402]
R147  10K  [r0402]
R148  NC/0R  [R0402]
R149  NC/0R  [R0402]
R150  NC/0R  [R0402]
R151  NC/0R  [R0402]
R152  NC/0R  [R0402]
R153  NC/0R  [R0402]
R154  0R  [R0402]
R155  0R  [R0402]
R156  0R  [R0402]
R157  0R  [R0402]
R158  0R  [R0402]
R159  0R  [R0402]
R160  0R  [R0402]
T18  TEST  [TEST]
T19  TEST  [TEST]
T20  TEST  [TEST]
T21  TEST  [TEST]
T22  TEST  [TEST]
T23  TEST  [TEST]
T24  TEST  [TEST]
T25  TEST  [TEST]
T26  TEST  [TEST]
T27  TEST  [TEST]
T28  TEST  [TEST]
T29  TEST  [TEST]
T30  TEST  [TEST]
T31  TEST  [TEST]
T32  TEST  [TEST]
T33  TEST  [TEST]
T34  TEST  [TEST]
T35  TEST  [TEST]
T36  TEST  [TEST]
T37  TEST  [TEST]
T38  TEST  [TEST]
T39  TEST  [TEST]
T40  TEST  [TEST]
T41  TEST  [TEST]
U23  SY7203  [QFN8-2X2]

### Blocks framed on the sheet
Placed on the DispalyPort: C259 C260 R134 R135

### Nets
GND: C258.2 C261.2 C262.2 C263.2 C264.1 C265.2 C267.2 C268.2 C269.1 C270.2 C271.2 CON1.8 CON1.9 CON1.10 J7.1(GND) J7.7(GND) J7.13(GND) J7.18(GND) J7.19(GND) J7.25(GND) J7.31(GND) J7.33(GND) J7.34(GND) J7.35(GND) J7.36(GND) Q9.2 R134.2 R136.1 R138.2 R139.2 R147.1 R154.2 R160.2 T18.1 T25.1 T27.1 T29.1 T38.1 U23.11(GND2)
LCD_VBAT: C258.1 C267.1 C268.1 J7.6(VCC_LCD) J7.8(VCC_LCD) J7.10(VCC_LCD) J7.12(VCC_LCD) J7.14(VCC_LCD) J7.16(VCC_LCD) Q8.3(DRAIN) T21.1
VCC50_BOOST: R148.2
VCC_BAT+: C261.1 C263.1 C264.2 C265.1 C266.2 L10.1 Q8.2(SOURCE) R140.2 U23.7(IN)
VCC_LCD: R135.2
VCC_TP: C270.1 C271.1 R145.1 R146.1 R155.2 T39.1
BL_EN: R136.2 U23.9(EN) ; off-sheet BL_EN
EDP_AUXN: C260.2 J7.27(EDP_EMI_N) R135.1 T33.1
EDP_AUXP: C259.2 J7.29(EDP_EMI_P) R134.1 T34.1
EDP_HPD: J7.4(eDP_HPD) T20.1
EDP_TX0N: J7.21(EDP_EMI_N0) T31.1 ; off-sheet EDP_TX0N
EDP_TX0P: J7.23(EDP_EMI_P0) T32.1 ; off-sheet EDP_TX0P
EDP_TX1N: J7.15(EDP_EMI_N1) T26.1 ; off-sheet EDP_TX1N
EDP_TX1P: J7.17(EDP_EMI_P1) T28.1 ; off-sheet EDP_TX1P
EDP_TX2N: J7.9(EDP_EMI_N2) T23.1 ; off-sheet EDP_TX2N
EDP_TX2P: J7.11(EDP_EMI_P2) T24.1 ; off-sheet EDP_TX2P
EDP_TX3N: J7.3(EDP_EMI_N3) T19.1 ; off-sheet EDP_TX3N
EDP_TX3P: J7.5(EDP_EMI_P3) T22.1 ; off-sheet EDP_TX3P
EDPAUXN: C260.1 ; off-sheet EDPAUXN
EDPAUXP: C259.1 ; off-sheet EDPAUXP
I2C4_SCL_TP: R145.2 R159.2 T37.1 ; off-sheet I2C4_SCL_TP
I2C4_SDA_TP: R146.2 R158.2 T36.1 ; off-sheet I2C4_SDA_TP
LCDC_BL: R142.1 ; off-sheet LCDC_BL
LCDPWR_EN: R144.2 ; off-sheet LCDPWR_EN
LED+: C262.1 D5.2(K) J7.32(LED_BACK_REG_A) T35.1 U23.8(OVP)
LED-: J7.20(LED_IO_6_A) J7.22(LED_IO_5_A) J7.24(LED_IO_4_A) J7.26(LED_IO_3_A) J7.28(LED_IO_2_A) J7.30(LED_IO_1_A) R137.2 R138.1 R139.1 T30.1
SPI2_CLK: R152.2 ; off-sheet SPI2_CLK
SPI2_CS: R153.2 ; off-sheet SPI2_CS
SPI2_INT: R149.2 ; off-sheet SPI2_INT
SPI2_MISO: R151.2 ; off-sheet SPI2_MISO
SPI2_MOSI: R150.2 ; off-sheet SPI2_MOSI
TOUCH_INT: R156.2 T40.1 ; off-sheet TOUCH_INT
TOUCH_RST: R157.2 T41.1 ; off-sheet TOUCH_RST
NetC266_1: C266.1 Q8.1(GATE) R140.1 R141.2
NetC269_2: C269.2 R142.2 R143.1
NetCON1_1: CON1.1 R148.1 R154.1
NetCON1_2: CON1.2 R155.1
NetCON1_3: CON1.3 R149.1 R156.1
NetCON1_4: CON1.4 R150.1 R157.1
NetCON1_5: CON1.5 R151.1 R158.1
NetCON1_6: CON1.6 R152.1 R159.1
NetCON1_7: CON1.7 R153.1 R160.1
NetD5_1: D5.1(A) L10.2 U23.4(LX1) U23.5(LX2)
NetQ9_1: Q9.1 R144.1 R147.2
NetQ9_3: Q9.3 R141.1
NetR137_1: R137.1 R143.2 U23.2(FB)

Not connected (* = marked no-connect by the designer): J7 2(CN_LCM_OFF_L); U23 1(NC1) 3(NC2) 6(NC3) 10(NC4)

### Notes on the sheet
- eDP Panel
- BACKLIGHT
- TOUCH

### Library data of the parts
C258-C260 = CAP NP_3: CAP,MLCC,100nF,+/-10%,X7R,6.3V,SMD0402
C261 C268 C271 = CAP NP_Dup3: CAP,MLCC,100nF,+/-10%,X7R,6.3V,SMD0402
C262 = CAP NP_Dup3: RoHS CHIP CAP 1uF +10/-10% 25V X5R
C263 = C0603
C264 = CAP NP_Dup2: RoHS CHIP CAP 1uF +10/-10% 16V X5R
C265 = CAP NP_4: RoHS CHIP CAP 22uF +10/-10% X5R
C266 = CAP NP_Dup2: NC/RoHS CHIP CAP0.1uF +10/-10% X5R
C267 = CAP NP_1_Dup1: CAP,MLCC,4.7uF,+/-10%,X5R,6.3V,SMD0603; Supplier P/N: GRM21BR61C106K; Supplier: MURATA
C269 = CAP NP_Dup3: RoHS CHIP CAP 0.1uF +10/-10% X7R
C270 = CAP NP_Dup3
CON1 = Con8_4.5mm
D5 = DIODE_Dup2
J7 = A070SN02_0.0: LCD_CON
L10 = INDUCTORS OF FERRITE
Q8 = MOSFET N_0: NC/MOSFET-P,WPM2341 ,-20V,+/-8V,-2.8A,56m Ohm@Vgs=-2.5V,44m Ohm@Vgs=-4.5V,SOT23
Q9 = NPN_0_Dup1: NC/Trans NPN,SS8050,25V,1500mA,10~60@Vce=1V,Ic=500mA, SOT-23
R134 R135 = RESISTOR_1_Dup1
R136 R142 R143 = RES 1B_Dup1: ROHS CHIP RES 4.7K 1/16W 5%
R137 = RES 1B_Dup1: ROHS CHIP RES 82K 1/16W 5%
R138 R139 = RES 1B_Dup1: ROHS CHIP RES 4.7R 1/4W 5%
R140 = RESISTOR_3: NC/ROHS CHIP RES 100K 1/16W +/-5%
R141 R147 = RESISTOR_3: NC/ROHS CHIP RES 10K 1/16W +/-5%
R144 = RESISTOR_3: NC/ROHS CHIP RES 22K 1/16W +/-5%
R145 R146 R148-R160 = RESISTOR_Dup1: ROHS CHIP RES 4.7K 1/16W 5%
T18-T41 = TEST_0
U23 = MP3202-QFN8_1

## Sheet 25.SchDoc
size 381 x 254 mm
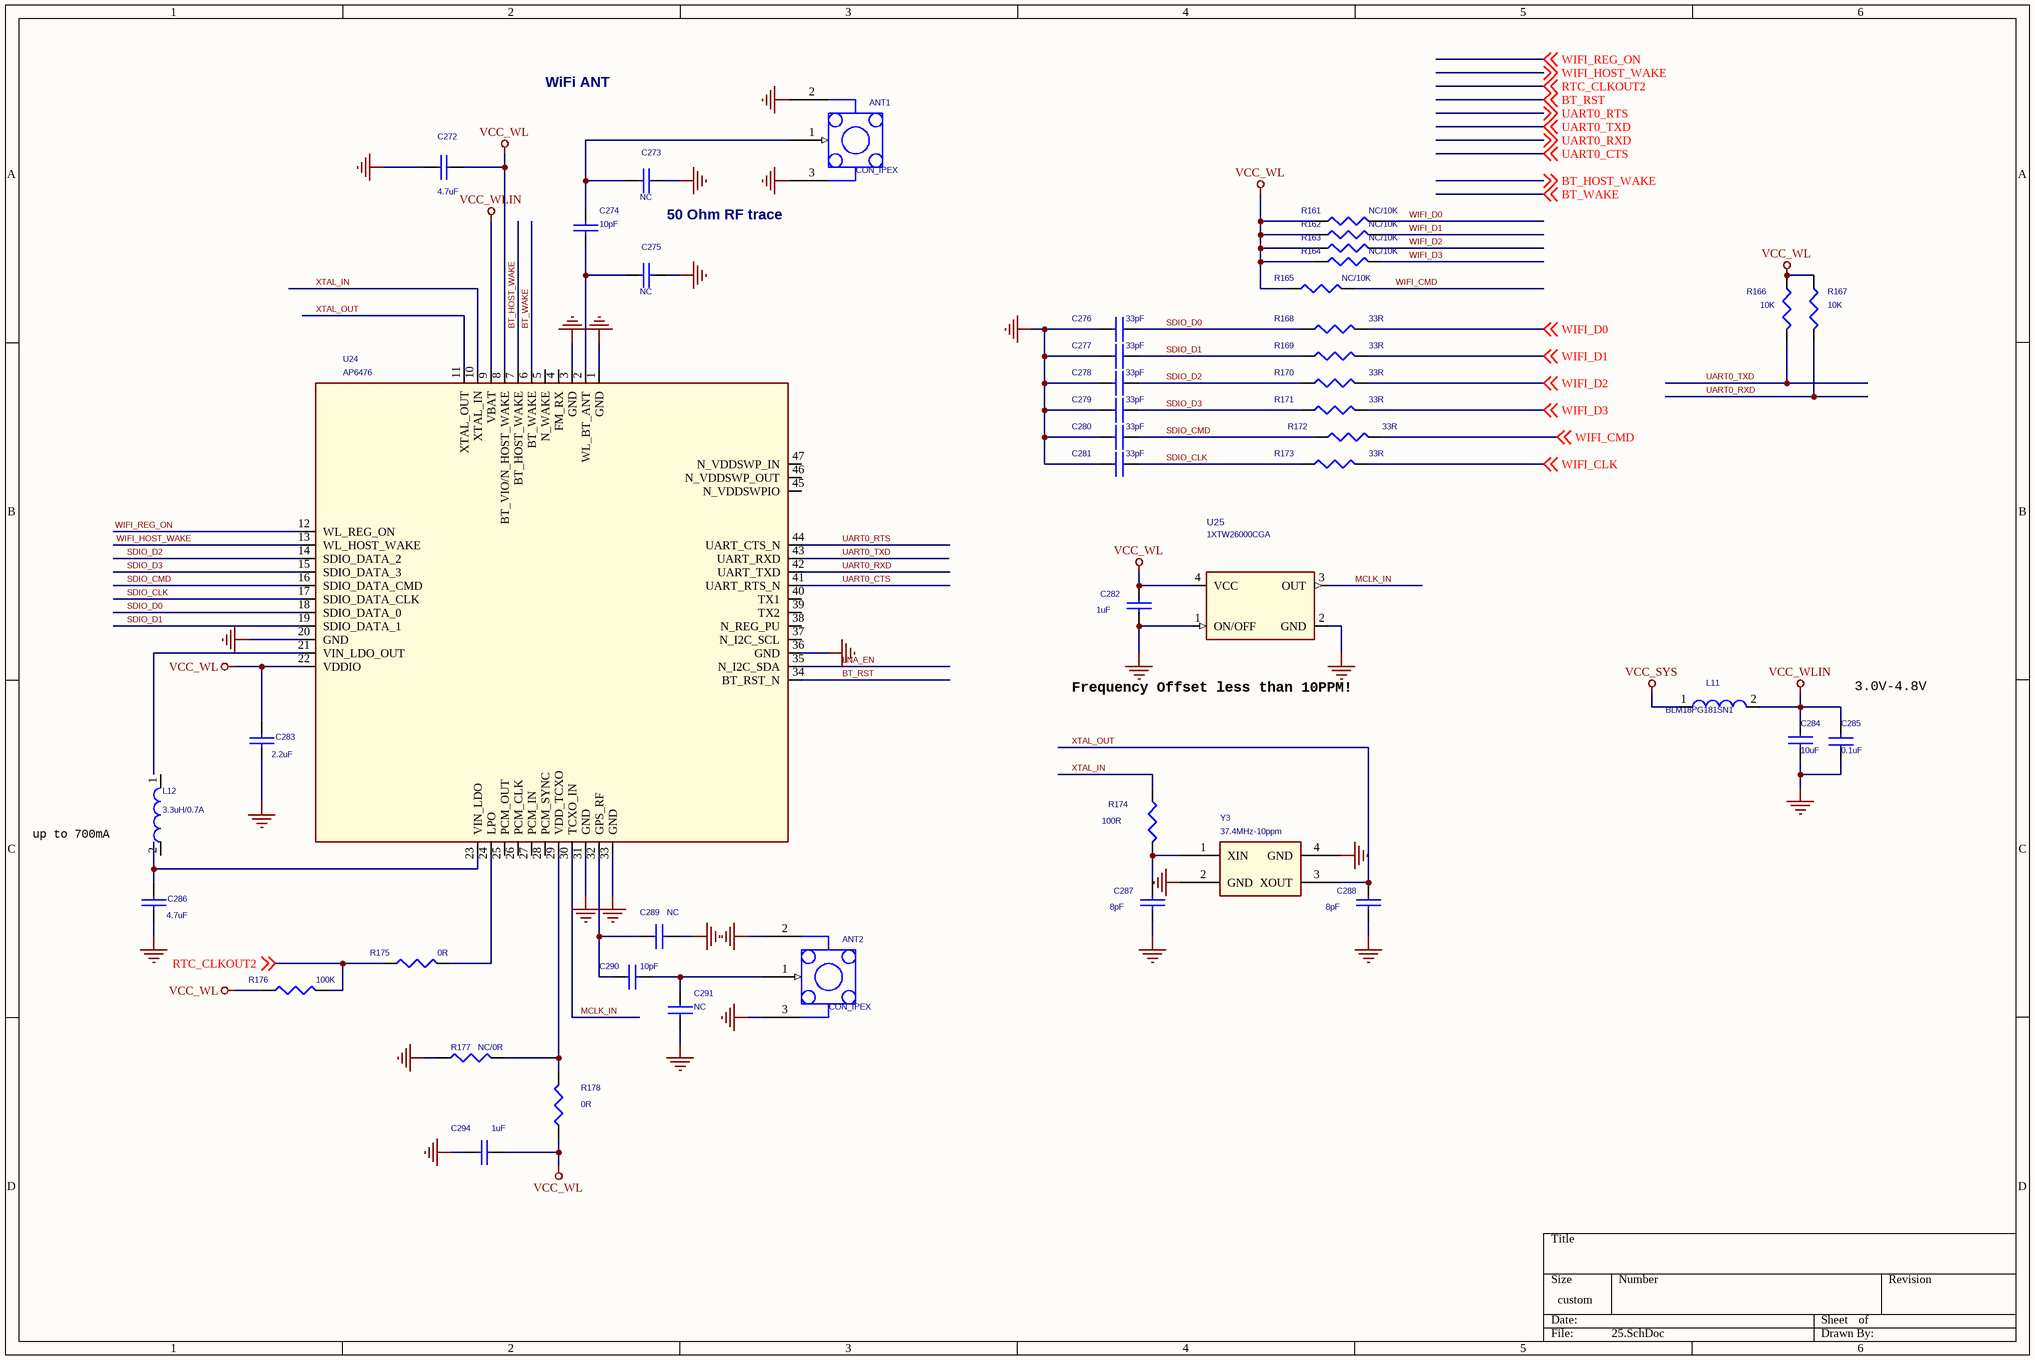
[diagram p25: 25.SchDoc]

### Parts
ANT1  CON_IPEX  [ANT-JACKA-1]
ANT2  CON_IPEX  [ANT-JACKA-1]
C272  4.7uF  [C0603]
C273  NC  [c0402]
C274  10pF  [c0402]
C275  NC  [c0402]
C276  33pF  [c0402]
C277  33pF  [c0402]
C278  33pF  [c0402]
C279  33pF  [c0402]
C280  33pF  [c0402]
C281  33pF  [c0402]
C282  1uF  [c0402]
C283  2.2uF  [C0402]
C284  10uF  [C0402]
C285  0.1uF  [C0402]
C286  4.7uF  [C0603]
C287  8pF  [c0402]
C288  8pF  [c0402]
C289  NC  [C0402]
C290  10pF  [C0402]
C291  NC  [C0402]
C294  1uF  [c0402]
L11  BLM18PG181SN1  [L0603]
L12  3.3uH/0.7A  [IND-3X3]
R161  NC/10K  [R0402]
R162  NC/10K  [R0402]
R163  NC/10K  [R0402]
R164  NC/10K  [R0402]
R165  NC/10K  [R0402]
R166  10K  [r0402]
R167  10K  [r0402]
R168  33R  [R0402]
R169  33R  [R0402]
R170  33R  [R0402]
R171  33R  [R0402]
R172  33R  [R0402]
R173  33R  [R0402]
R174  100R  [R0402]
R175  0R  [R0402]
R176  100K  [R0402]
R177  NC/0R  [R0402]
R178  0R  [R0402]
U24  AP6476  [AP6XXX]
U25  1XTW26000CGA  [CRY-D3225]
Y3  37.4MHz-10ppm  [CRY-3225]

### Nets
GND: ANT1.2(GND1) ANT1.3(GND2) ANT2.2(GND1) ANT2.3(GND2) C272.2 C273.2 C275.2 C276.2 C277.2 C278.2 C279.2 C280.2 C281.2 C282.1 C283.1 C284.2 C285.1 C286.1 C287.1 C288.1 C289.2 C291.2 C294.2 R177.2 U24.1(GND) U24.3(GND) U24.20(GND) U24.31(GND) U24.33(GND) U24.36(GND) U25.1(ON/OFF) U25.2(GND) Y3.2(GND) Y3.4(GND)
VCC_SYS: L11.1
VCC_WL: C272.1 C282.2 C283.2 C294.1 R161.1 R162.1 R163.1 R164.1 R165.1 R166.2 R167.2 R176.1 R178.2 U24.8(BT_VIO/N_HOST_WAKE) U24.22(VDDIO) U25.4(VCC)
VCC_WLIN: C284.1 C285.2 L11.2 U24.9(VBAT)
BT_HOST_WAKE: U24.7(BT_HOST_WAKE) ; off-sheet BT_HOST_WAKE
BT_RST: U24.34(BT_RST_N) ; off-sheet BT_RST
BT_WAKE: U24.6(BT_WAKE) ; off-sheet BT_WAKE
LNA_EN: U24.35(N_I2C_SDA)
MCLK_IN: U24.30(TCXO_IN) U25.3(OUT)
RTC_CLKOUT2: R175.1 R176.2 ; off-sheet RTC_CLKOUT2
SDIO_CLK: C281.1 R173.1 U24.17(SDIO_DATA_CLK)
SDIO_CMD: C280.1 R172.1 U24.16(SDIO_DATA_CMD)
SDIO_D0: C276.1 R168.1 U24.18(SDIO_DATA_0)
SDIO_D1: C277.1 R169.1 U24.19(SDIO_DATA_1)
SDIO_D2: C278.1 R170.1 U24.14(SDIO_DATA_2)
SDIO_D3: C279.1 R171.1 U24.15(SDIO_DATA_3)
UART0_CTS: U24.41(UART_RTS_N) ; off-sheet UART0_CTS
UART0_RTS: U24.44(UART_CTS_N) ; off-sheet UART0_RTS
UART0_RXD: R167.1 U24.42(UART_TXD) ; off-sheet UART0_RXD
UART0_TXD: R166.1 U24.43(UART_RXD) ; off-sheet UART0_TXD
WIFI_CLK: R173.2 ; off-sheet WIFI_CLK
WIFI_CMD: R165.2 R172.2 ; off-sheet WIFI_CMD
WIFI_D0: R161.2 R168.2 ; off-sheet WIFI_D0
WIFI_D1: R162.2 R169.2 ; off-sheet WIFI_D1
WIFI_D2: R163.2 R170.2 ; off-sheet WIFI_D2
WIFI_D3: R164.2 R171.2 ; off-sheet WIFI_D3
WIFI_HOST_WAKE: U24.13(WL_HOST_WAKE) ; off-sheet WIFI_HOST_WAKE
WIFI_REG_ON: U24.12(WL_REG_ON) ; off-sheet WIFI_REG_ON
XTAL_IN: R174.2 U24.10(XTAL_IN)
XTAL_OUT: C288.2 U24.11(XTAL_OUT) Y3.3(XOUT)
NetANT1_1: ANT1.1(IN) C273.1 C274.2
NetANT2_1: ANT2.1(IN) C290.2 C291.1
NetC274_1: C274.1 C275.1 U24.2(WL_BT_ANT)
NetC286_2: C286.2 U24.23(VIN_LDO)
NetC287_2: C287.2 R174.1 Y3.1(XIN)
NetC289_1: C289.1 C290.1 U24.32(GPS_RF)
NetR175_2: R175.2 U24.24(LPO)
NetR177_1: R177.1 R178.1 U24.29(VDD_TCXO)

Not connected (* = marked no-connect by the designer): L12 1 2; U24 4(FM_RX) 5(N_WAKE) 21(VIN_LDO_OUT) 25(PCM_OUT) 26(PCM_CLK) 27(PCM_IN) 28(PCM_SYNC) 37(N_I2C_SCL) 38(N_REG_PU) 39(TX2) 40(TX1) 45(N_VDDSWPIO) 46(N_VDDSWP_OUT) 47(N_VDDSWP_IN)

### Notes on the sheet
- WiFi ANT
- (near C273) 50 Ohm RF trace
- Frequency Offset less than 10PPM!
- (near C285) 3.0V-4.8V
- up to 700mA

### Library data of the parts
ANT1 ANT2 = CON_IPEX_0: Atanna jack,3pin,SMT; OriginalSymbolOrigin: (-100,200); PATH: ?; JEDEC_TYPE: ?
C272 C286 = CAPNP_Dup1_1: RoHS CHIP CAP 4.7uF +10/-10% X5R; BOM_VALUE: 0; BOM_TYPE: 30
C273 C275 = CAPNP_Dup1_1: BOM_TYPE: 30; BOM_VALUE: 0
C274 = CAPNP_Dup1_1: RoHS CHIP CAP 10pF +10/-10% X7R; BOM_TYPE: 20; BOM_VALUE: 0
C276-C281 = CAP NP_Dup1: CAP,MLCC,10uF,+/-10%,X5R,6.3V,SMD0805
C282 C288 C294 = CAPNP_Dup1_1: RoHS CHIP CAP 8pF +/-1% NPO; BOM_VALUE: 0; BOM_TYPE: 30
C283 = CAPNP_Dup1_1: RoHS CHIP CAP 2.2uF +10/-10% X5R; BOM_VALUE: 0; BOM_TYPE: 30
C284 = CAP NP_Dup2: CAP,MLCC,4.7uF,+/-10%,X5R,6.3V,SMD0603; Supplier P/N: GRM21BR61C106K; Supplier: MURATA
C285 = CAP NP_Dup2: CAP,MLCC,100nF,+/-10%,X7R,6.3V,SMD0402; Supplier P/N: GRM21BR61C106K; Supplier: MURATA
C287 = CAPNP_Dup1_1: RoHS CHIP CAP 8pF +/-1% NPO; BOM_TYPE: 30; BOM_VALUE: 0
C289-C291 = CAP NP_Dup2: RoHS CHIP CAP 2.2uF +10/-10% X5R
L11 = INDUCTOR: Part number: SM01V00480I; Vendor: TAITECH; Type: SMD
L12 = INDUCTOR: CoilInd,Shielded(SHLD),1.5uH@100KHz,+/-30%,0.7A,40mOhm,SMD,3.0*3.0*2.0; BOM_TYPE: 20; BOM_VALUE: 0
R161-R165 = RESISTOR_Dup1: ROHS CHIP RES 10K 1/16W +/-5%
R166 R167 = RESISTOR_4: ROHS CHIP RES 10K 1/16W +/-5%; BOM_TYPE: 20; BOM_VALUE: 0
R168-R173 R177 R178 = RESISTOR_Dup1: RES,thick film,33Ohm,+/-5%,1/16W,SMD0402
R174 = R_0: ROHS CHIP RES 100 Ohm 1/16W +/-5%; BOM_VALUE: 0; BOM_TYPE: 20
R175 = RESISTOR_Dup1: ROHS CHIP RES 200 Ohm 1/16W +/-5%; BOM_TYPE: 20; BOM_VALUE: 0
R176 = RESISTOR_Dup1: ROHS CHIP RES 100K 1/16W +/-5%; BOM_VALUE: 0; BOM_TYPE: 20
U24 = AP6493_0: WIFI&BT; BOM_VALUE: 8; Device: AMPAK_SIP; QVL: AMPAK; ORCAD_LIB: MODULE; BOM_TYPE: 10
U25 = CRYSTAL OSC: 1XTW26000CGA  KDS TCXO 26MHZ 1.8V 0.5PPM ,SMD3225
Y3 = CRYSTAL-4_0: Crystal,24.000MHz,+/-20ppm,12pF,SMD3225,-10°C ~ +60   °C; BOM_TYPE: 62; BOM_VALUE: 0

## Nets that join several sheets
GND: 05 (138 pins), 06 (10 pins), 07 (110 pins), 08 (14 pins), 09 (8 pins), 10 (C102.2 C103.2 C104.2), 11 (74 pins), 13 (9 pins), 14 (11 pins), 15 (C159.2), 16 (14 pins), 17 (6 pins), 18 (35 pins), 19 (14 pins), 20 (52 pins), 21 (11 pins), 22 (24 pins), 23 (14 pins), 24 (39 pins), 25 (34 pins)
VCC18_DVP: 05 (C54.1 U4.1), 15 (C159.1 U8.U20), 23 (6 pins)
VCC18_LCD: 05 (C39.1 U2.K3), 16 (C162.1 C163.1 U8.AA17)
VCC28_DVP: 05 (C56.1 U4.6), 23 (C254.2 C256.2 U22.4)
VCC50_BOOST: 06 (6 pins), 24 (R148.2)
VCC50_USB: 05 (Q1.2), 08 (7 pins)
VCC_18: 05 (C43.1 U2.J3), 13 (C154.2 U8.E21), 14 (C156.2 R66.1 U8.R20), 20 (C211.2 R103.1)
VCC_BAT+: 05 (8 pins), 24 (9 pins)
VCC_DDR: 05 (5 pins), 11 (63 pins)
VCC_FLASH: 10 (6 pins), 21 (14 pins), 22 (22 pins)
VCC_IO: 05 (8 pins), 11 (C136.2 R52.1 U10.1), 17 (C174.2 C176.1 U8.J20 U8.Y12), 18 (29 pins), 20 (C201.2 R99.1 U15.29), 22 (11 pins)
VCC_LCD: 05 (C20.1 C21.1 L5.2 U2.D7), 16 (C164.1 C165.1 U8.V20), 24 (R135.2)
VCC_SD: 05 (C30.1 U2.J4), 19 (C193.2 C194.1 J4.4 R87.1)
VCC_SYS: 05 (30 pins), 06 (C61.2 Q2.2 R26.2), 14 (R62.2), 18 (C188.2 C189.2 R77.1), 20 (C228.1 FB6.1), 25 (L11.1)
VCC_TP: 05 (C29.1 U2.K4), 24 (6 pins)
VCC_USBPWR: 05 (Q1.1 R13.2), 06 (C66.2 U7.1), 08 (D2.1)
VCC_WL: 05 (C34.1 U2.K5), 17 (C177.2 U8.AA11), 25 (16 pins)
VCCA_CODEC: 05 (C46.1 U2.J5), 20 (5 pins)
VCCIO_PMU: 05 (7 pins), 09 (C101.2 U8.P20), 13 (C155.2 U8.F20), 17 (C175.2 R68.2 U8.L20)
VCCIO_SD: 05 (C37.1 U2.K7), 17 (C178.1 U8.AC9)
VDD10_LCD: 05 (C36.1 U2.H6), 16 (C160.1 C161.1 U8.Y17)
VDD_10: 05 (C42.1 U2.H3), 09 (C99.2 C100.2 U8.M20 U8.P28), 13 (C153.2 U8.G18 U8.H20)
VDD_CPU: 05 (C4.1 C7.1 L2.2 R3.1), 07 (21 pins)
VDD_GPU: 05 (C2.1 C3.1 L1.2 R1.1), 07 (21 pins)
VDD_LOG: 05 (C23.1 C24.1 L6.2 U2.E2), 07 (16 pins)
5V_DRV: 06 (R30.1), 17 (U8.J22)
BAT_DET: 05 (C40.2 R12.1 R14.2), 14 (U8.P24)
BL_EN: 17 (U8.D28), 24 (R136.2 U23.9)
BT_HOST_WAKE: 17 (U8.AD9), 25 (U24.7)
BT_RST: 17 (U8.AF8), 25 (U24.34)
BT_WAKE: 17 (U8.AF9), 25 (U24.6)
CIF_CLKI: 15 (U8.V22), 23 (C255.2 R129.2)
CIF_CLKO: 15 (U8.R22), 23 (R130.2)
CIF_D0: 15 (U8.R27), 23 (U22.19)
CIF_D1: 15 (U8.R26), 23 (U22.21)
CIF_D2: 15 (U8.Y23), 23 (U22.22)
CIF_D3: 15 (U8.Y21), 23 (U22.20)
CIF_D4: 15 (U8.Y22), 23 (U22.18)
CIF_D5: 15 (U8.V21), 23 (U22.16)
CIF_D6: 15 (U8.U22), 23 (U22.14)
CIF_D7: 15 (U8.U21), 23 (U22.12)
CIF_HREF: 15 (U8.R28), 23 (U22.9)
CIF_PDN0: 15 (U8.R24), 23 (U22.8)
CIF_PWR: 05 (U4.3 U4.4), 09 (U8.M23)
CIF_VSYNC: 15 (U8.R25), 23 (U22.7)
COMP_INT: 17 (U8.C27), 18 (R72.2 U12.A1)
DDRIO_RETEN: 09 (U8.J26), 11 (R59.2)
EDP_TX0N: 16 (C167.2), 24 (J7.21 T31.1)
EDP_TX0P: 16 (C166.2), 24 (J7.23 T32.1)
EDP_TX1N: 16 (C169.2), 24 (J7.15 T26.1)
EDP_TX1P: 16 (C168.2), 24 (J7.17 T28.1)
EDP_TX2N: 16 (C171.2), 24 (J7.9 T23.1)
EDP_TX2P: 16 (C170.2), 24 (J7.11 T24.1)
EDP_TX3N: 16 (C173.2), 24 (J7.3 T19.1)
EDP_TX3P: 16 (C172.2), 24 (J7.5 T22.1)
EDPAUXN: 16 (U8.AH18), 24 (C260.1)
EDPAUXP: 16 (U8.AG18), 24 (C259.1)
FLASH0_ALE: 10 (U8.AF4), 21 (U18.17)
FLASH0_CLE: 10 (U8.AH3), 21 (T14.1 U18.16)
FLASH0_CS0: 10 (U8.AC5), 21 (U18.9)
FLASH0_CS1: 10 (U8.AD4), 21 (U18.10)
FLASH0_CS2/EMMC_CMD: 10 (U8.AC4), 21 (U18.14), 22 (R123.2 U19.W5)
FLASH0_CS3/EMMC_RST: 10 (U8.Y7), 21 (U18.15)
FLASH0_D0: 10 (U8.AE3), 21 (U18.29), 22 (R116.2 U19.H3)
FLASH0_D1: 10 (U8.AD3), 21 (U18.30), 22 (R115.2 U19.H4)
FLASH0_D2: 10 (U8.AF3), 21 (U18.31), 22 (R117.2 U19.H5)
FLASH0_D3: 10 (U8.AF1), 21 (U18.32), 22 (R118.2 U19.J2)
FLASH0_D4: 10 (U8.AF2), 21 (U18.41), 22 (R119.2 U19.J3)
FLASH0_D5: 10 (U8.AG3), 21 (U18.42), 22 (R120.2 U19.J4)
FLASH0_D6: 10 (U8.AG1), 21 (U18.43), 22 (R121.2 U19.J5)
FLASH0_D7: 10 (U8.AG2), 21 (U18.44), 22 (R122.2 U19.J6)
FLASH0_DQS/EMMC_CLKO: 10 (U8.AB6), 21 (U18.35), 22 (R124.1 T16.1)
FLASH0_RDN: 10 (U8.Y6), 21 (U18.8)
FLASH0_RDY: 10 (U8.AH2), 21 (5 pins)
FLASH0_WP/EMMC_PWREN: 10 (U8.AH1), 21 (U18.19), 22 (R125.2 U19.U5)
FLASH0_WRN: 10 (U8.AG4), 21 (U18.18)
GSEN_INT: 17 (U8.D24), 18 (U11.11 U14.11)
GYR_INT: 17 (U8.G21), 18 (R76.2 U14.10)
HALL_INT: 09 (U8.L22), 18 (C186.1 R75.2 U13.2)
HP_DET: 17 (U8.E27), 20 (C209.2 R99.2 R100.2)
I2C0_SCL_PMIC: 05 (R24.1 U1.A3 U2.E7 U3.A3), 09 (U8.M21)
I2C0_SDA_PMIC: 05 (R23.1 U1.B1 U2.E6 U3.B1), 09 (U8.M25)
I2C1_SCL_Sensor: 17 (U8.E25), 18 (R74.2 U11.4 U12.A3 U14.2)
I2C1_SDA_Sensor: 17 (U8.A28), 18 (R73.2 U11.6 U12.A4 U14.4)
I2C2_SCL_AUDIO: 17 (U8.AD12), 20 (R91.1 U15.26)
I2C2_SDA_AUDIO: 17 (U8.AF12), 20 (R93.1 U15.27)
I2C3_SCL_CAM: 15 (U8.P22), 23 (R132.2 U22.5)
I2C3_SDA_CAM: 15 (U8.R23), 23 (R133.2 U22.3)
I2C4_SCL_TP: 17 (U8.J23), 24 (R145.2 R159.2 T37.1)
I2C4_SDA_TP: 17 (U8.H25), 24 (R146.2 R158.2 T36.1)
I2S0_CLK: 17 (U8.AC12), 20 (R92.1)
I2S0_LRCK_RX: 17 (U8.AG11), 20 (R98.1)
I2S0_LRCK_TX: 17 (U8.AF11), 20 (R97.1)
I2S0_SCLK: 17 (U8.AD11), 20 (R94.1)
I2S0_SDI: 17 (U8.AE11), 20 (R90.1)
I2S0_SDO0: 17 (U8.AG12), 20 (R89.1)
LCDC_BL: 17 (U8.H22), 24 (R142.1)
LCDPWR_EN: 17 (U8.F25), 24 (R144.2)
OTG_DET: 08 (C95.2 R35.1 R36.2 R37.2), 13 (U8.D23)
OTG_DM: 08 (FB1.4 R33.1), 13 (U8.A26)
OTG_DP: 08 (FB1.2 R34.1), 13 (U8.B26)
OTG_ID: 08 (ED4.1 J2.4), 13 (U8.C25)
OTG_VBUS_DRV: 06 (R31.2), 09 (U8.M28)
PMIC_INT: 05 (U2.J2), 09 (U8.K28)
PMIC_SLEEP: 05 (U1.A1 U2.F4 U3.A1), 09 (U8.J28)
PWR_KEY: 05 (R19.1), 09 (U8.L21)
PWRKEY1: 05 (C53.1 R20.1 U2.E4), 14 (Q4.3)
RESET: 05 (C57.1 R21.2 U2.F5), 09 (C96.2 U8.M27)
RTC_CLKOUT1: 05 (U2.G7), 09 (U8.P25)
RTC_CLKOUT2: 05 (R25.1), 25 (R175.1 R176.2)
SDMMC_CLK: 17 (U8.AG6), 19 (R83.1)
SDMMC_CMD: 17 (U8.AC8), 19 (R82.1)
SDMMC_D0: 17 (U8.AG7), 19 (R84.1)
SDMMC_D1: 17 (U8.AH6), 19 (R85.1)
SDMMC_D2: 17 (U8.AD8), 19 (R80.1)
SDMMC_D3: 17 (U8.AB9), 19 (R81.1)
SDMMC_DET: 17 (U8.AH5), 19 (R86.1 R87.2)
SPI2_CLK: 17 (U8.D26), 24 (R152.2)
SPI2_CS: 17 (U8.D27), 24 (R153.2)
SPI2_INT: 17 (U8.B28), 24 (R149.2)
SPI2_MISO: 17 (U8.F24), 24 (R151.2)
SPI2_MOSI: 17 (U8.C28), 24 (R150.2)
SPK_CTL: 17 (U8.G27), 20 (R109.1 U16.C2 U17.C2)
TOUCH_INT: 17 (U8.F26), 24 (R156.2 T40.1)
TOUCH_RST: 17 (U8.G24), 24 (R157.2 T41.1)
UART0_CTS: 17 (U8.AB12), 25 (U24.41)
UART0_RTS: 17 (U8.AB11), 25 (U24.44)
UART0_RXD: 17 (U8.AH11), 25 (R167.1 U24.42)
UART0_TXD: 17 (U8.AG10), 25 (R166.1 U24.43)
USB_INT: 08 (R36.1), 09 (U8.M24)
VDD_CPU_FB: 05 (R3.2 U3.A4), 07 (U8.T14)
VDD_GPU_FB: 05 (R1.2 U1.A4), 07 (U8.M15)
VIB_CTL: 17 (U8.H27), 18 (R78.2 R79.1)
WIFI_CLK: 17 (U8.AG8), 25 (R173.2)
WIFI_CMD: 17 (U8.AH8), 25 (R165.2 R172.2)
WIFI_D0: 17 (U8.AH9), 25 (R161.2 R168.2)
WIFI_D1: 17 (U8.AH10), 25 (R162.2 R169.2)
WIFI_D2: 17 (U8.AG9), 25 (R163.2 R170.2)
WIFI_D3: 17 (U8.AH7), 25 (R164.2 R171.2)
WIFI_HOST_WAKE: 17 (U8.AE8), 25 (U24.13)
WIFI_REG_ON: 17 (U8.AC11), 25 (U24.12)